# EAGLE design HFT_VHF-UHF-TRX_1V0 (EAGLE 7.7.0)

## Sheet 1 of 6: AX_1
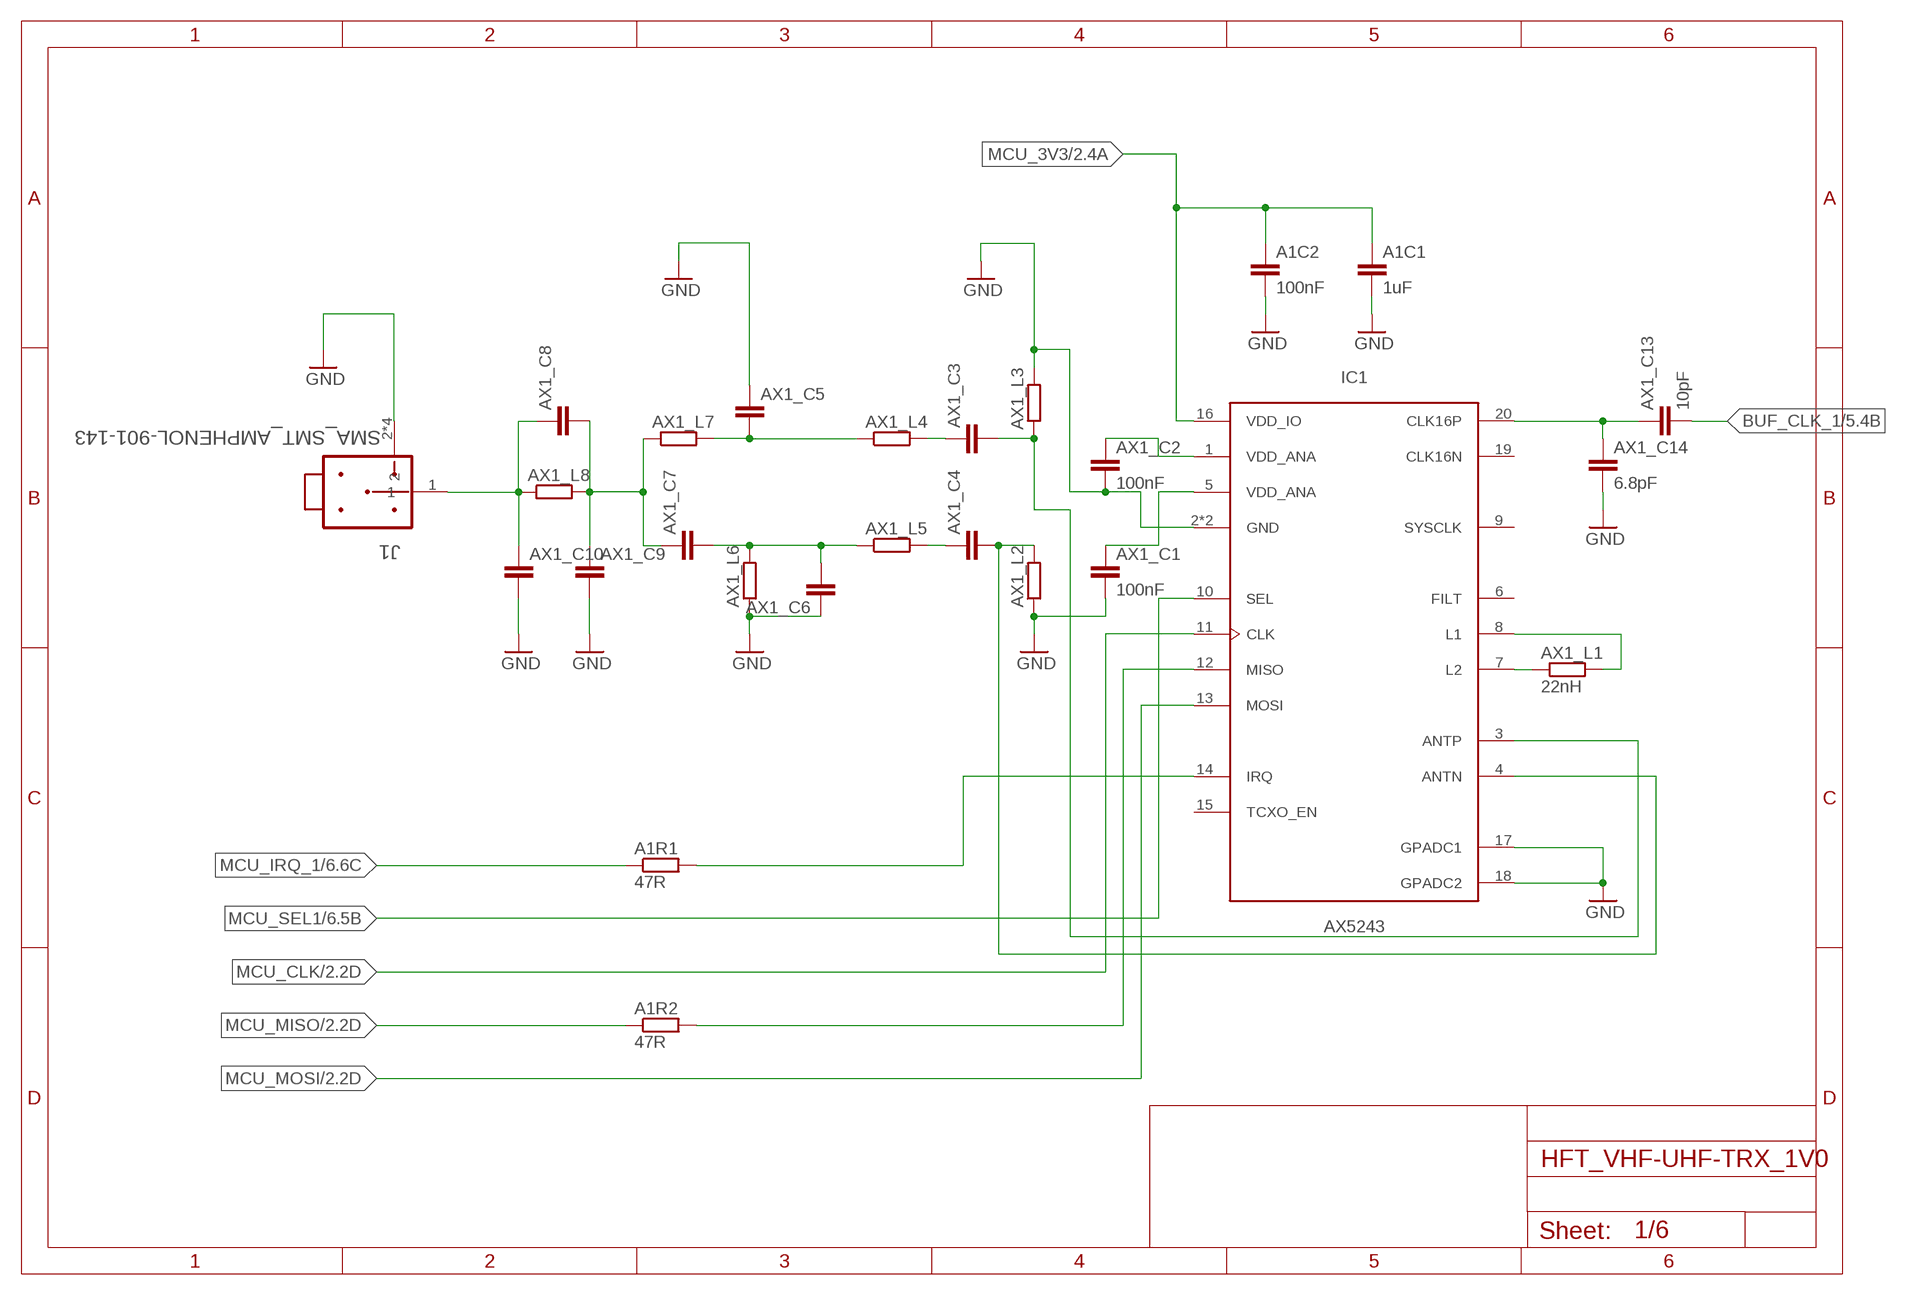
[diagram p0: schematic, sheet 1]

### Parts
A1C1  1uF  C-EUC0805  [C0805]
A1C2  100nF  C-EUC0805  [C0805]
A1R1  47R  R-EU_R0805  [R0805]
A1R2  47R  R-EU_R0805  [R0805]
AX1_C1  100nF  C-EUC0805  [C0805]
AX1_C2  100nF  C-EUC0805  [C0805]
AX1_C3  C-EUC0805  [C0805]
AX1_C4  C-EUC0805  [C0805]
AX1_C5  C-EUC0805  [C0805]
AX1_C6  C-EUC0805  [C0805]
AX1_C7  C-EUC0805  [C0805]
AX1_C8  C-EUC0805  [C0805]
AX1_C9  C-EUC0805  [C0805]
AX1_C10  C-EUC0805  [C0805]
AX1_C13  10pF  C-EUC0805  [C0805]
AX1_C14  6.8pF  C-EUC0805  [C0805]
AX1_L1  22nH  R-EU_R0805  [R0805]
AX1_L2  R-EU_R0805  [R0805]
AX1_L3  R-EU_R0805  [R0805]
AX1_L4  R-EU_R0805  [R0805]
AX1_L5  R-EU_R0805  [R0805]
AX1_L6  R-EU_R0805  [R0805]
AX1_L7  R-EU_R0805  [R0805]
AX1_L8  R-EU_R0805  [R0805]
IC1  AX5243  [QFN20-4X4-0P5-PAD]
J1  SMA_SMT_AMPHENOL-901-143  [SMA_SMT_AMPHENOL_901-143]

### Nets
AX1_C3_L4: AX1_C3.1 AX1_L4.2
AX1_C4_L5: AX1_C4.1 AX1_L5.2
AX1_CH1_ANA1: AX1_C2.1 IC1.1(VDD_ANA)
AX1_CH1_ANA2: AX1_C1.1 IC1.5(VDD_ANA)
AX1_CH1_ANTN: AX1_C4.2 AX1_L2.2 IC1.4(ANTN)
AX1_CH1_ANTP: AX1_C3.2 AX1_L3.1 IC1.3(ANTP)
AX1_CH_1: AX1_C8.1 AX1_C10.1 AX1_L8.1 J1.1
AX1_IRQ_1: A1R1.2 IC1.14(IRQ)
AX1_L1: AX1_L1.2 IC1.8(L1)
AX1_L2: AX1_L1.1 IC1.7(L2)
AX1_L4_C5_L7: AX1_C5.2 AX1_L4.1 AX1_L7.2
AX1_L4_C7_L8: AX1_C7.1 AX1_C8.2 AX1_C9.1 AX1_L7.1 AX1_L8.2
AX1_L5_C6_L6_C7: AX1_C6.2 AX1_C7.2 AX1_L5.1 AX1_L6.2
AX1_MISO: A1R2.2 IC1.12(MISO)
BUF_CLK_1: AX1_C13.2 ; also sheet 5
BUF_CLK_A1: AX1_C13.1 AX1_C14.1 IC1.20(CLK16P)
GND [Hicur]: A1C1.2 A1C2.2 AX1_C1.2 AX1_C2.2 AX1_C5.1 AX1_C6.1 AX1_C9.2 AX1_C10.2 AX1_C14.2 AX1_L2.1 AX1_L3.2 AX1_L6.1 IC1.2(GND) IC1.17(GPADC1) IC1.18(GPADC2) IC1.21(GND) J1.2 J1.3 J1.4 J1.5 ; also sheet 2,3,4,5,6
MCU_3V3 [Hicur]: A1C1.1 A1C2.1 IC1.16(VDD_IO) ; also sheet 2,3,4,5,6
MCU_CLK: IC1.11(CLK) ; also sheet 2,3,4,6
MCU_IRQ_1: A1R1.1 ; also sheet 6
MCU_MISO: A1R2.1 ; also sheet 2,3,4,6
MCU_MOSI: IC1.13(MOSI) ; also sheet 2,3,4,6
MCU_SEL1: IC1.10(SEL) ; also sheet 6
Unconnected: IC1.6(FILT) IC1.9(SYSCLK) IC1.15(TCXO_EN) IC1.19(CLK16N)

## Sheet 2 of 6: AX_2
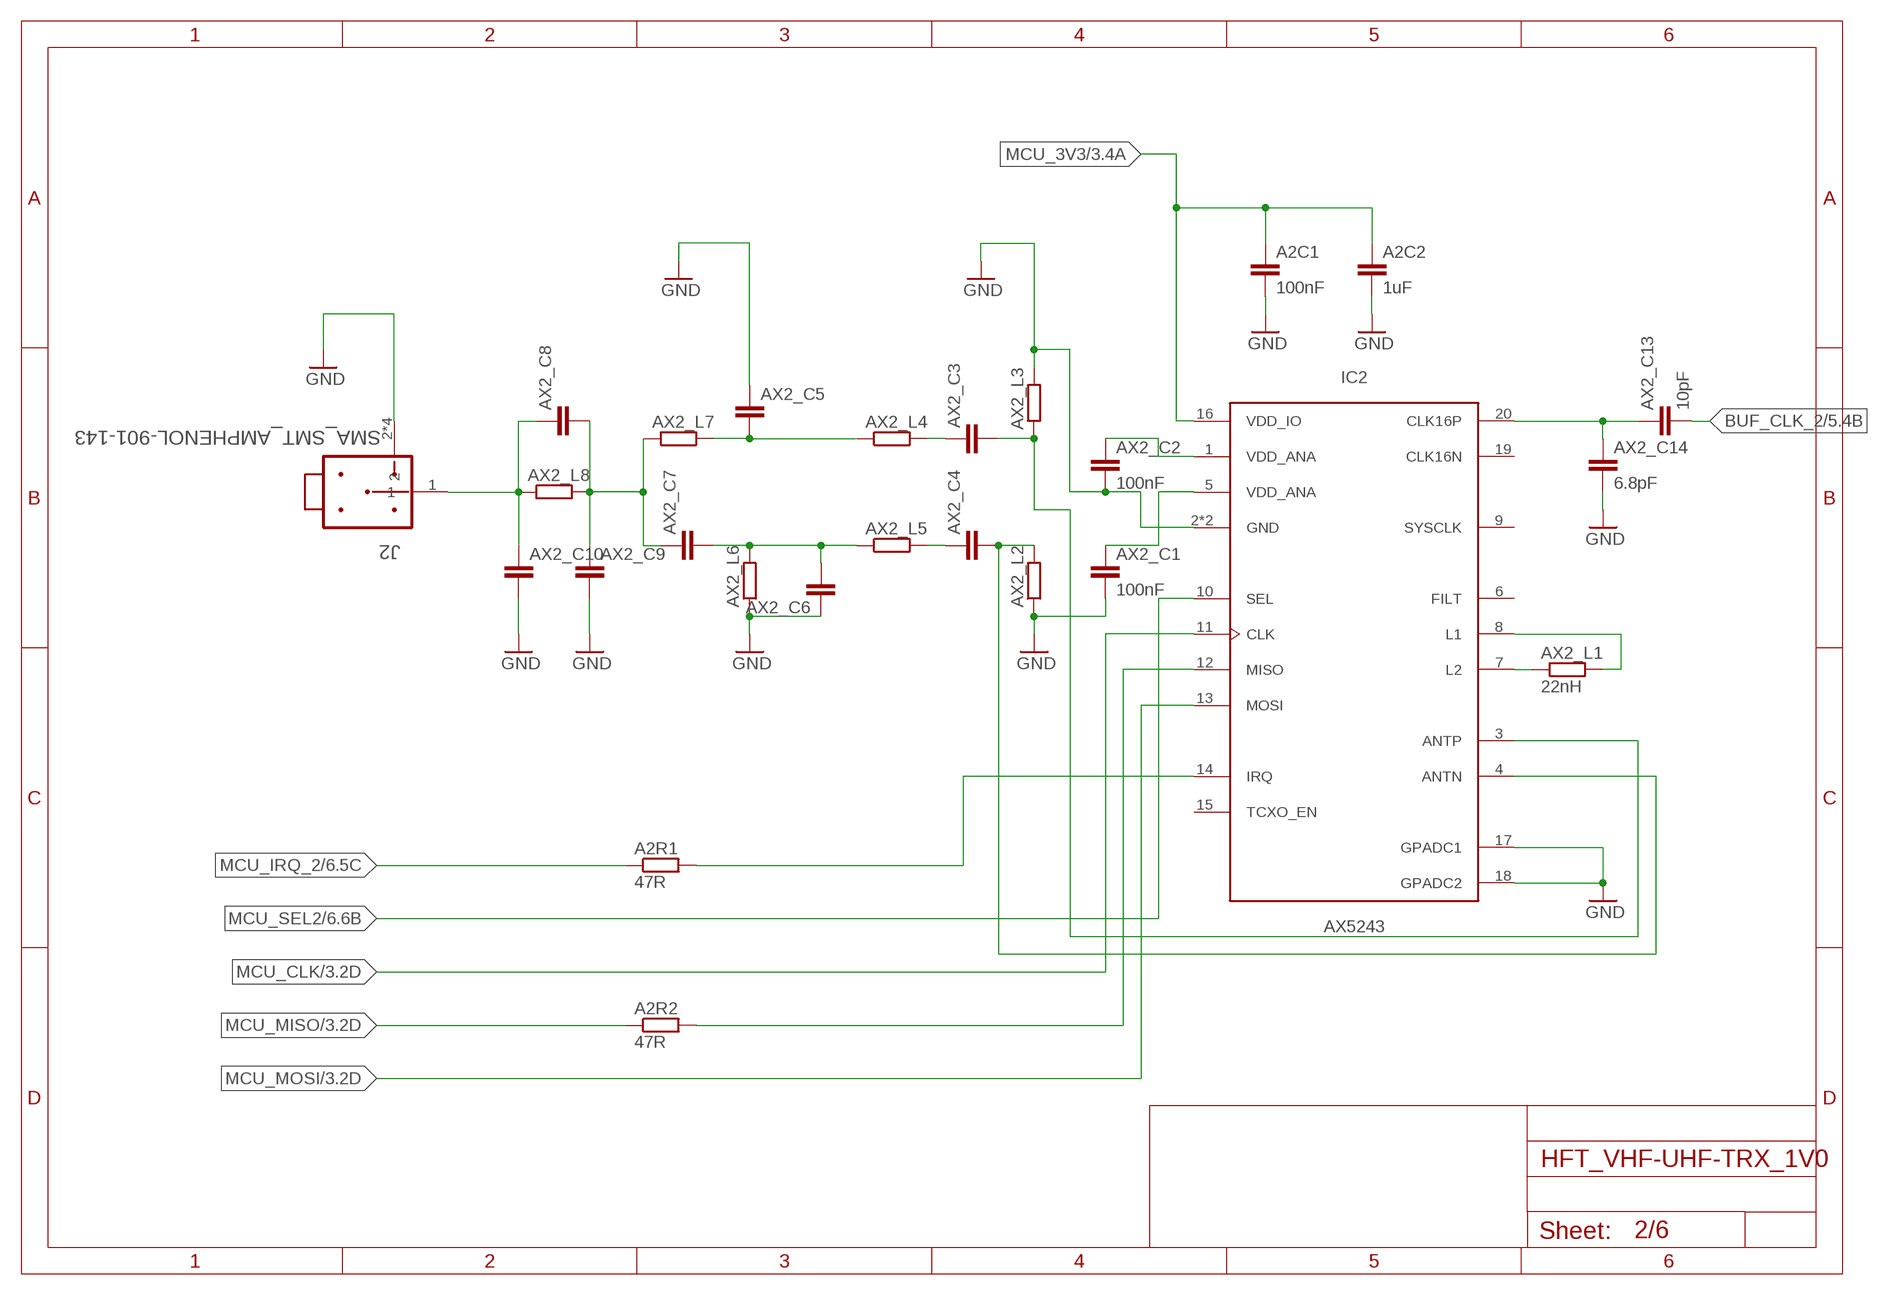
[diagram p1: schematic, sheet 2]

### Parts
A2C1  100nF  C-EUC0805  [C0805]
A2C2  1uF  C-EUC0805  [C0805]
A2R1  47R  R-EU_R0805  [R0805]
A2R2  47R  R-EU_R0805  [R0805]
AX2_C1  100nF  C-EUC0805  [C0805]
AX2_C2  100nF  C-EUC0805  [C0805]
AX2_C3  C-EUC0805  [C0805]
AX2_C4  C-EUC0805  [C0805]
AX2_C5  C-EUC0805  [C0805]
AX2_C6  C-EUC0805  [C0805]
AX2_C7  C-EUC0805  [C0805]
AX2_C8  C-EUC0805  [C0805]
AX2_C9  C-EUC0805  [C0805]
AX2_C10  C-EUC0805  [C0805]
AX2_C13  10pF  C-EUC0805  [C0805]
AX2_C14  6.8pF  C-EUC0805  [C0805]
AX2_L1  22nH  R-EU_R0805  [R0805]
AX2_L2  R-EU_R0805  [R0805]
AX2_L3  R-EU_R0805  [R0805]
AX2_L4  R-EU_R0805  [R0805]
AX2_L5  R-EU_R0805  [R0805]
AX2_L6  R-EU_R0805  [R0805]
AX2_L7  R-EU_R0805  [R0805]
AX2_L8  R-EU_R0805  [R0805]
IC2  AX5243  [QFN20-4X4-0P5-PAD]
J2  SMA_SMT_AMPHENOL-901-143  [SMA_SMT_AMPHENOL_901-143]

### Nets
AX2_C3_L4: AX2_C3.1 AX2_L4.2
AX2_C4_L5: AX2_C4.1 AX2_L5.2
AX2_CH2_ANA1: AX2_C2.1 IC2.1(VDD_ANA)
AX2_CH2_ANA2: AX2_C1.1 IC2.5(VDD_ANA)
AX2_CH2_ANTN: AX2_C4.2 AX2_L2.2 IC2.4(ANTN)
AX2_CH2_ANTP: AX2_C3.2 AX2_L3.1 IC2.3(ANTP)
AX2_CH_2: AX2_C8.1 AX2_C10.1 AX2_L8.1 J2.1
AX2_IRQ_2: A2R1.2 IC2.14(IRQ)
AX2_L1: AX2_L1.2 IC2.8(L1)
AX2_L2: AX2_L1.1 IC2.7(L2)
AX2_L4_C5_L7: AX2_C5.2 AX2_L4.1 AX2_L7.2
AX2_L4_C7_L8: AX2_C7.1 AX2_C8.2 AX2_C9.1 AX2_L7.1 AX2_L8.2
AX2_L5_C6_L6_C7: AX2_C6.2 AX2_C7.2 AX2_L5.1 AX2_L6.2
AX2_MISO: A2R2.2 IC2.12(MISO)
BUF_CLK_2: AX2_C13.2 ; also sheet 5
BUF_CLK_A2: AX2_C13.1 AX2_C14.1 IC2.20(CLK16P)
GND [Hicur]: A2C1.2 A2C2.2 AX2_C1.2 AX2_C2.2 AX2_C5.1 AX2_C6.1 AX2_C9.2 AX2_C10.2 AX2_C14.2 AX2_L2.1 AX2_L3.2 AX2_L6.1 IC2.2(GND) IC2.17(GPADC1) IC2.18(GPADC2) IC2.21(GND) J2.2 J2.3 J2.4 J2.5 ; also sheet 1,3,4,5,6
MCU_3V3 [Hicur]: A2C1.1 A2C2.1 IC2.16(VDD_IO) ; also sheet 1,3,4,5,6
MCU_CLK: IC2.11(CLK) ; also sheet 1,3,4,6
MCU_IRQ_2: A2R1.1 ; also sheet 6
MCU_MISO: A2R2.1 ; also sheet 1,3,4,6
MCU_MOSI: IC2.13(MOSI) ; also sheet 1,3,4,6
MCU_SEL2: IC2.10(SEL) ; also sheet 6
Unconnected: IC2.6(FILT) IC2.9(SYSCLK) IC2.15(TCXO_EN) IC2.19(CLK16N)

## Sheet 3 of 6: AX_3
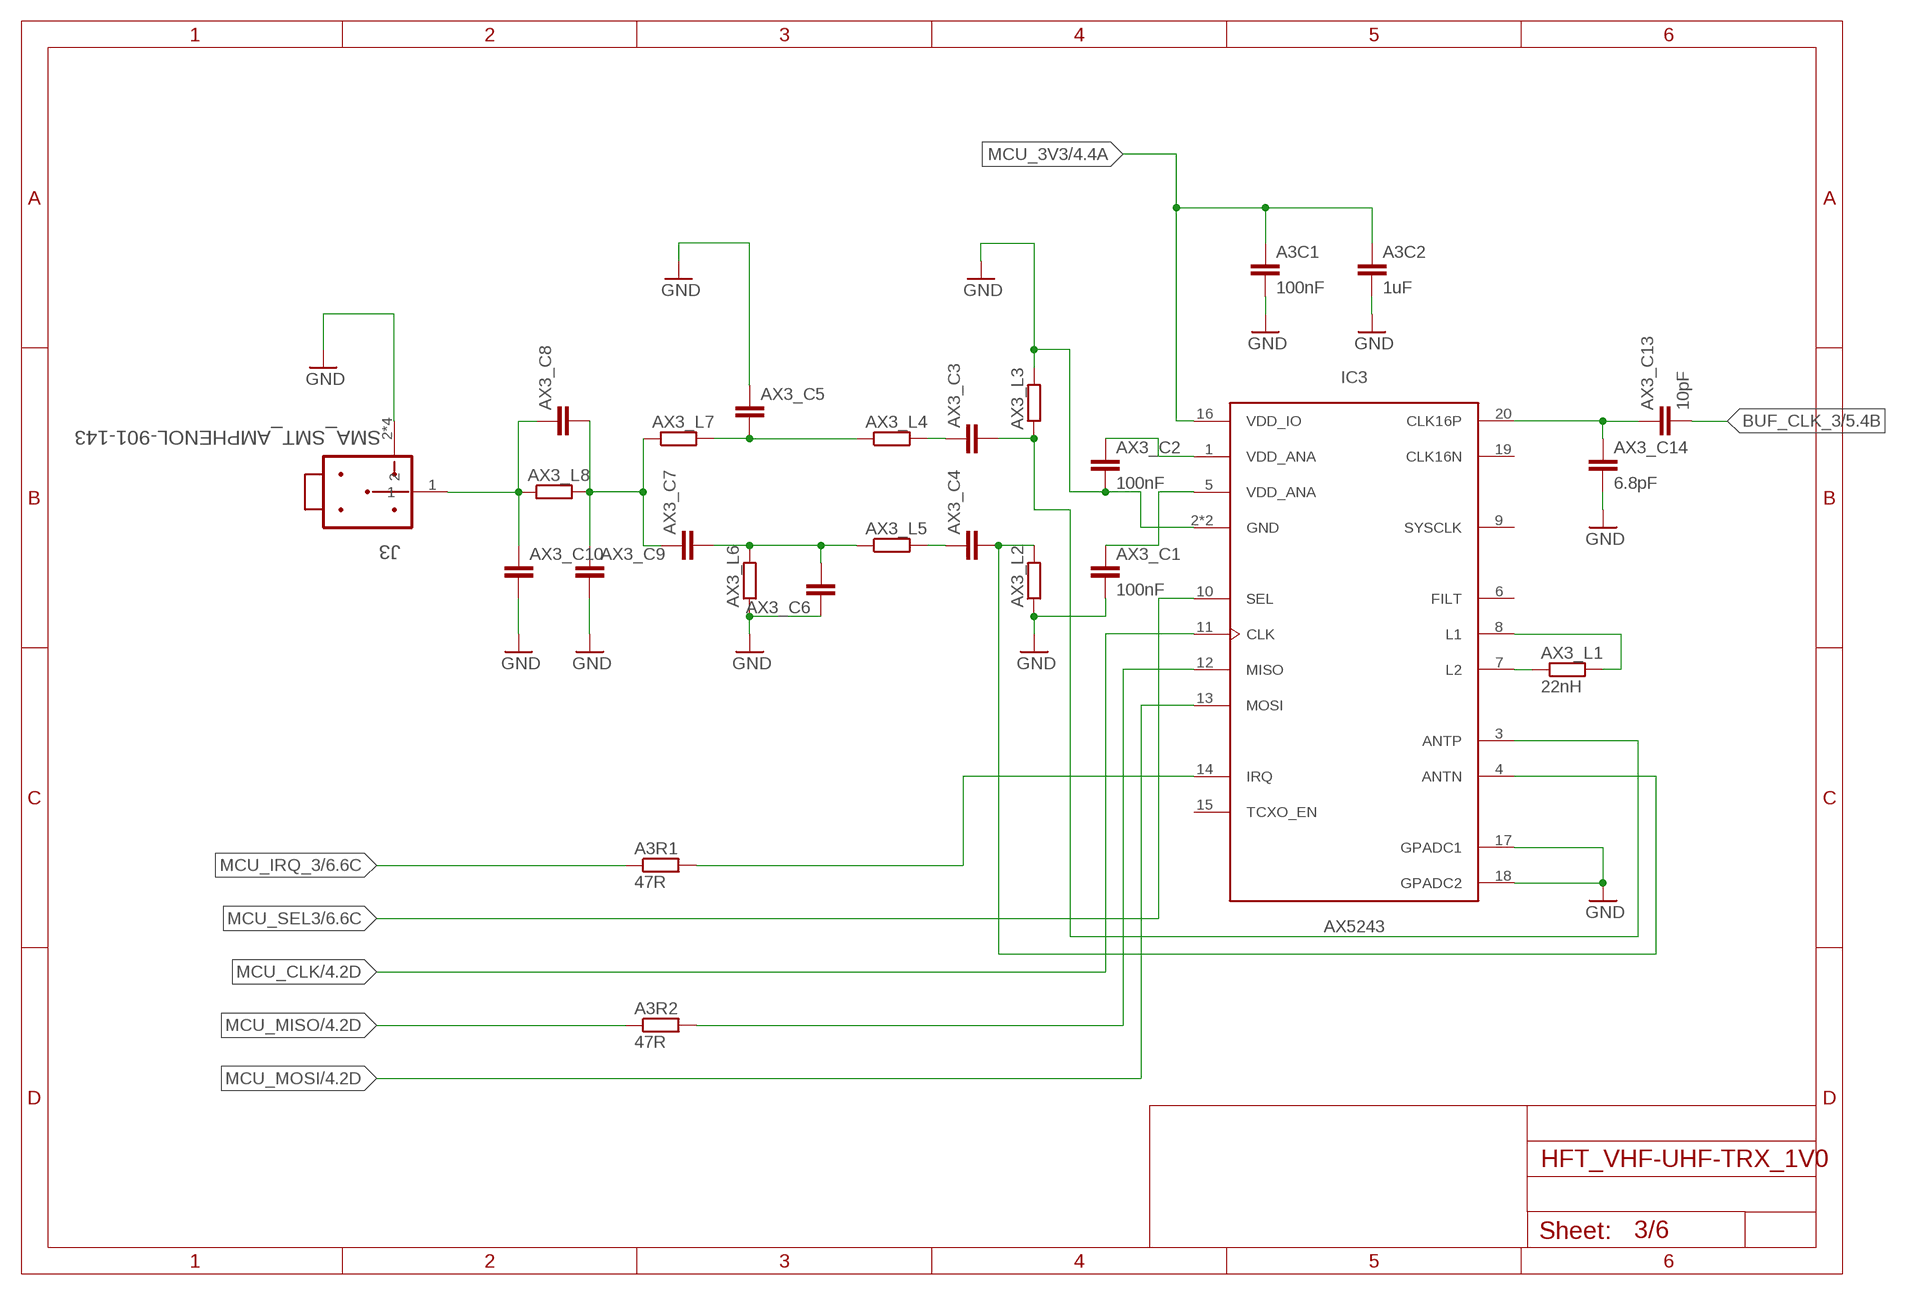
[diagram p2: schematic, sheet 3]

### Parts
A3C1  100nF  C-EUC0805  [C0805]
A3C2  1uF  C-EUC0805  [C0805]
A3R1  47R  R-EU_R0805  [R0805]
A3R2  47R  R-EU_R0805  [R0805]
AX3_C1  100nF  C-EUC0805  [C0805]
AX3_C2  100nF  C-EUC0805  [C0805]
AX3_C3  C-EUC0805  [C0805]
AX3_C4  C-EUC0805  [C0805]
AX3_C5  C-EUC0805  [C0805]
AX3_C6  C-EUC0805  [C0805]
AX3_C7  C-EUC0805  [C0805]
AX3_C8  C-EUC0805  [C0805]
AX3_C9  C-EUC0805  [C0805]
AX3_C10  C-EUC0805  [C0805]
AX3_C13  10pF  C-EUC0805  [C0805]
AX3_C14  6.8pF  C-EUC0805  [C0805]
AX3_L1  22nH  R-EU_R0805  [R0805]
AX3_L2  R-EU_R0805  [R0805]
AX3_L3  R-EU_R0805  [R0805]
AX3_L4  R-EU_R0805  [R0805]
AX3_L5  R-EU_R0805  [R0805]
AX3_L6  R-EU_R0805  [R0805]
AX3_L7  R-EU_R0805  [R0805]
AX3_L8  R-EU_R0805  [R0805]
IC3  AX5243  [QFN20-4X4-0P5-PAD]
J3  SMA_SMT_AMPHENOL-901-143  [SMA_SMT_AMPHENOL_901-143]

### Nets
AX3_C3_L4: AX3_C3.1 AX3_L4.2
AX3_C4_L5: AX3_C4.1 AX3_L5.2
AX3_CH3_ANA1: AX3_C2.1 IC3.1(VDD_ANA)
AX3_CH3_ANA2: AX3_C1.1 IC3.5(VDD_ANA)
AX3_CH3_ANTN: AX3_C4.2 AX3_L2.2 IC3.4(ANTN)
AX3_CH3_ANTP: AX3_C3.2 AX3_L3.1 IC3.3(ANTP)
AX3_CH_3: AX3_C8.1 AX3_C10.1 AX3_L8.1 J3.1
AX3_IRQ_3: A3R1.2 IC3.14(IRQ)
AX3_L1: AX3_L1.2 IC3.8(L1)
AX3_L2: AX3_L1.1 IC3.7(L2)
AX3_L4_C5_L7: AX3_C5.2 AX3_L4.1 AX3_L7.2
AX3_L4_C7_L8: AX3_C7.1 AX3_C8.2 AX3_C9.1 AX3_L7.1 AX3_L8.2
AX3_L5_C6_L6_C7: AX3_C6.2 AX3_C7.2 AX3_L5.1 AX3_L6.2
AX3_MISO: A3R2.2 IC3.12(MISO)
BUF_CLK_3: AX3_C13.2 ; also sheet 5
BUF_CLK_A3: AX3_C13.1 AX3_C14.1 IC3.20(CLK16P)
GND [Hicur]: A3C1.2 A3C2.2 AX3_C1.2 AX3_C2.2 AX3_C5.1 AX3_C6.1 AX3_C9.2 AX3_C10.2 AX3_C14.2 AX3_L2.1 AX3_L3.2 AX3_L6.1 IC3.2(GND) IC3.17(GPADC1) IC3.18(GPADC2) IC3.21(GND) J3.2 J3.3 J3.4 J3.5 ; also sheet 1,2,4,5,6
MCU_3V3 [Hicur]: A3C1.1 A3C2.1 IC3.16(VDD_IO) ; also sheet 1,2,4,5,6
MCU_CLK: IC3.11(CLK) ; also sheet 1,2,4,6
MCU_IRQ_3: A3R1.1 ; also sheet 6
MCU_MISO: A3R2.1 ; also sheet 1,2,4,6
MCU_MOSI: IC3.13(MOSI) ; also sheet 1,2,4,6
MCU_SEL3: IC3.10(SEL) ; also sheet 6
Unconnected: IC3.6(FILT) IC3.9(SYSCLK) IC3.15(TCXO_EN) IC3.19(CLK16N)

## Sheet 4 of 6: AX_4
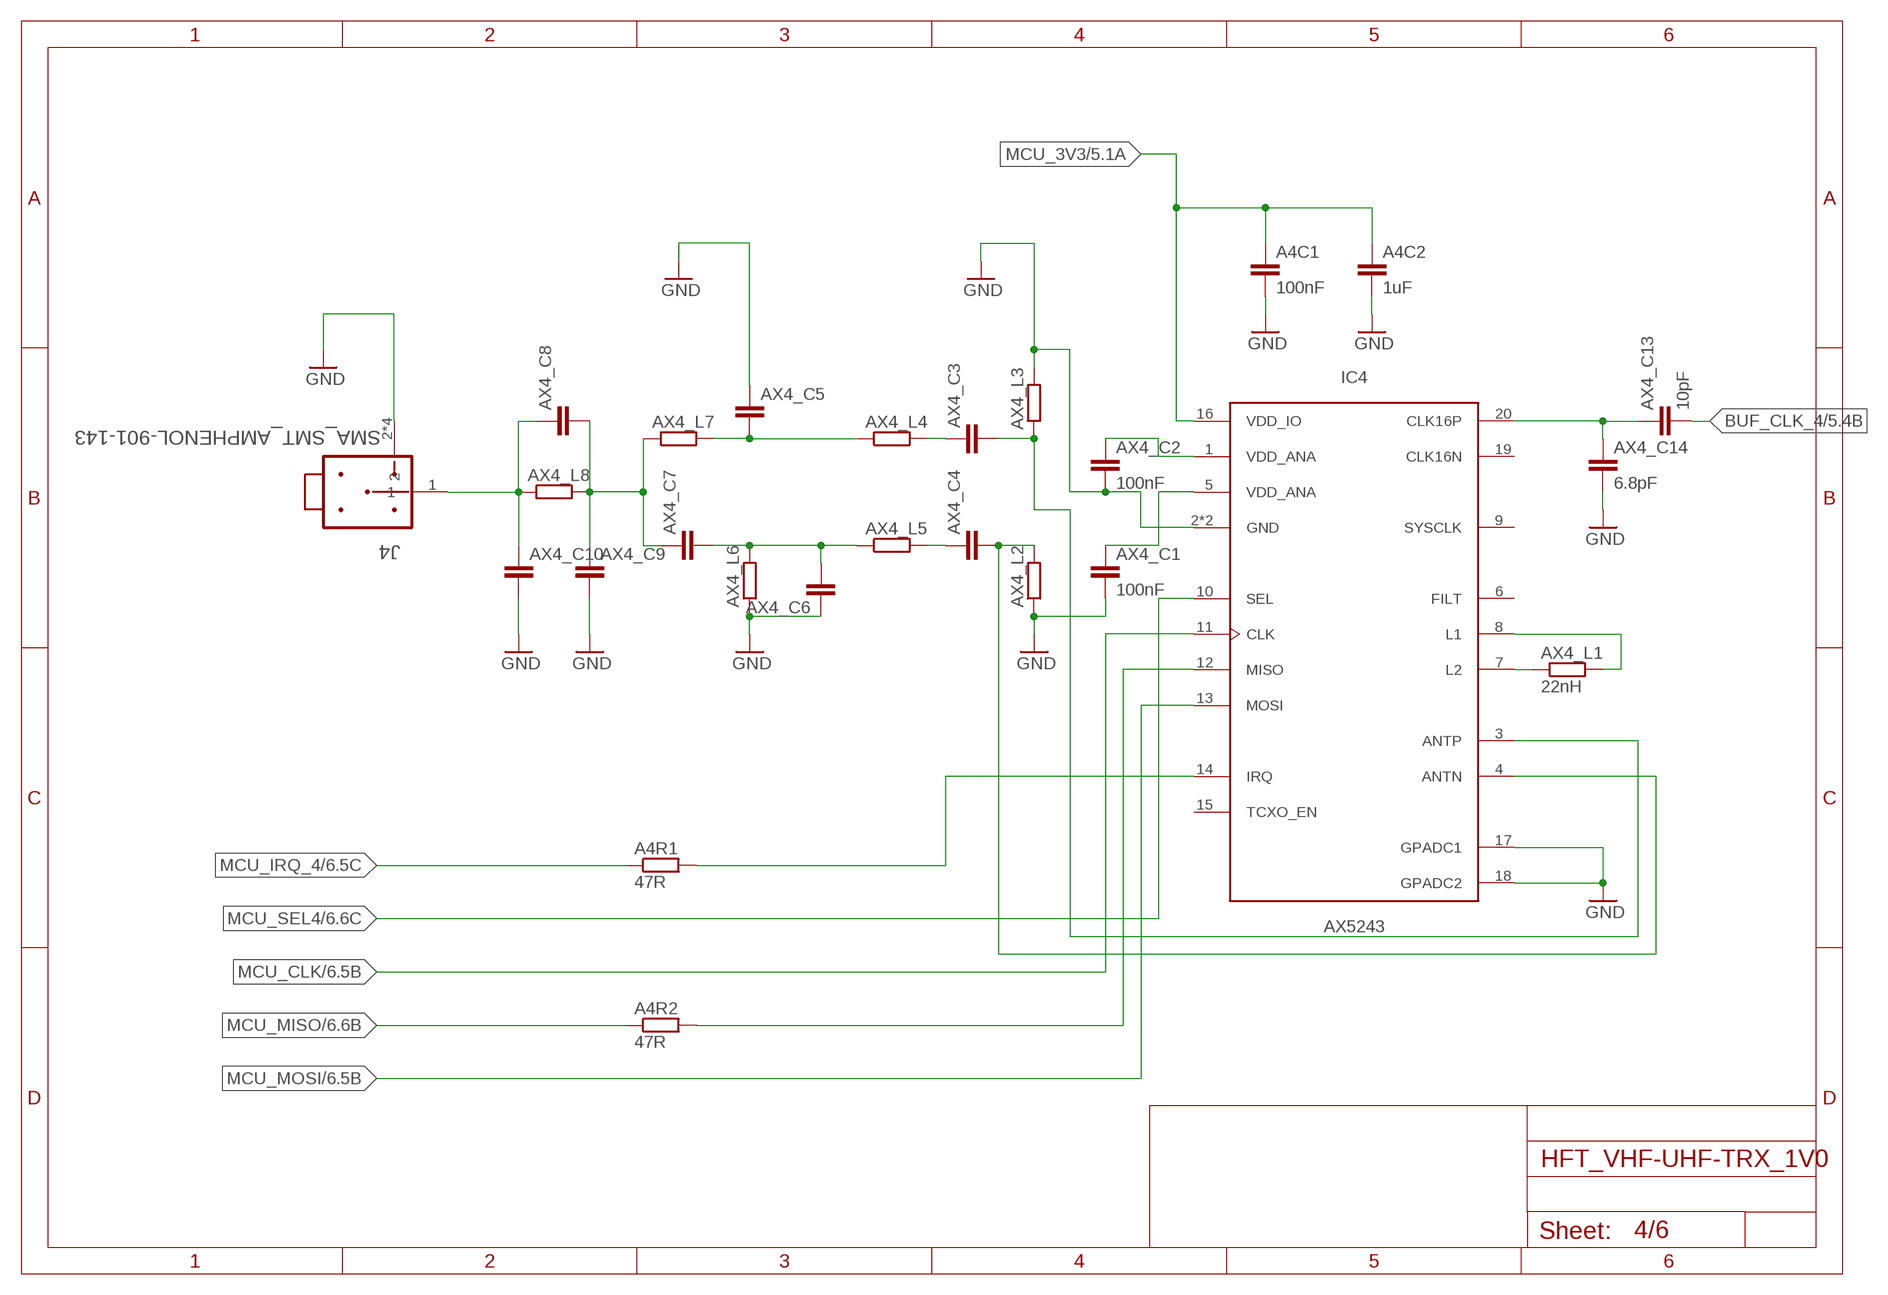
[diagram p3: schematic, sheet 4]

### Parts
A4C1  100nF  C-EUC0805  [C0805]
A4C2  1uF  C-EUC0805  [C0805]
A4R1  47R  R-EU_R0805  [R0805]
A4R2  47R  R-EU_R0805  [R0805]
AX4_C1  100nF  C-EUC0805  [C0805]
AX4_C2  100nF  C-EUC0805  [C0805]
AX4_C3  C-EUC0805  [C0805]
AX4_C4  C-EUC0805  [C0805]
AX4_C5  C-EUC0805  [C0805]
AX4_C6  C-EUC0805  [C0805]
AX4_C7  C-EUC0805  [C0805]
AX4_C8  C-EUC0805  [C0805]
AX4_C9  C-EUC0805  [C0805]
AX4_C10  C-EUC0805  [C0805]
AX4_C13  10pF  C-EUC0805  [C0805]
AX4_C14  6.8pF  C-EUC0805  [C0805]
AX4_L1  22nH  R-EU_R0805  [R0805]
AX4_L2  R-EU_R0805  [R0805]
AX4_L3  R-EU_R0805  [R0805]
AX4_L4  R-EU_R0805  [R0805]
AX4_L5  R-EU_R0805  [R0805]
AX4_L6  R-EU_R0805  [R0805]
AX4_L7  R-EU_R0805  [R0805]
AX4_L8  R-EU_R0805  [R0805]
IC4  AX5243  [QFN20-4X4-0P5-PAD]
J4  SMA_SMT_AMPHENOL-901-143  [SMA_SMT_AMPHENOL_901-143]

### Nets
AX4_C3_L4: AX4_C3.1 AX4_L4.2
AX4_C4_L5: AX4_C4.1 AX4_L5.2
AX4_CH4_ANA1: AX4_C2.1 IC4.1(VDD_ANA)
AX4_CH4_ANA2: AX4_C1.1 IC4.5(VDD_ANA)
AX4_CH4_ANTN: AX4_C4.2 AX4_L2.2 IC4.4(ANTN)
AX4_CH4_ANTP: AX4_C3.2 AX4_L3.1 IC4.3(ANTP)
AX4_CH_4: AX4_C8.1 AX4_C10.1 AX4_L8.1 J4.1
AX4_IRQ_4: A4R1.2 IC4.14(IRQ)
AX4_L1: AX4_L1.2 IC4.8(L1)
AX4_L2: AX4_L1.1 IC4.7(L2)
AX4_L4_C5_L7: AX4_C5.2 AX4_L4.1 AX4_L7.2
AX4_L4_C7_L8: AX4_C7.1 AX4_C8.2 AX4_C9.1 AX4_L7.1 AX4_L8.2
AX4_L5_C6_L6_C7: AX4_C6.2 AX4_C7.2 AX4_L5.1 AX4_L6.2
AX4_MISO: A4R2.2 IC4.12(MISO)
BUF_CLK_4: AX4_C13.2 ; also sheet 5
BUF_CLK_A4: AX4_C13.1 AX4_C14.1 IC4.20(CLK16P)
GND [Hicur]: A4C1.2 A4C2.2 AX4_C1.2 AX4_C2.2 AX4_C5.1 AX4_C6.1 AX4_C9.2 AX4_C10.2 AX4_C14.2 AX4_L2.1 AX4_L3.2 AX4_L6.1 IC4.2(GND) IC4.17(GPADC1) IC4.18(GPADC2) IC4.21(GND) J4.2 J4.3 J4.4 J4.5 ; also sheet 1,2,3,5,6
MCU_3V3 [Hicur]: A4C1.1 A4C2.1 IC4.16(VDD_IO) ; also sheet 1,2,3,5,6
MCU_CLK: IC4.11(CLK) ; also sheet 1,2,3,6
MCU_IRQ_4: A4R1.1 ; also sheet 6
MCU_MISO: A4R2.1 ; also sheet 1,2,3,6
MCU_MOSI: IC4.13(MOSI) ; also sheet 1,2,3,6
MCU_SEL4: IC4.10(SEL) ; also sheet 6
Unconnected: IC4.6(FILT) IC4.9(SYSCLK) IC4.15(TCXO_EN) IC4.19(CLK16N)

## Sheet 5 of 6: Clock Buffer
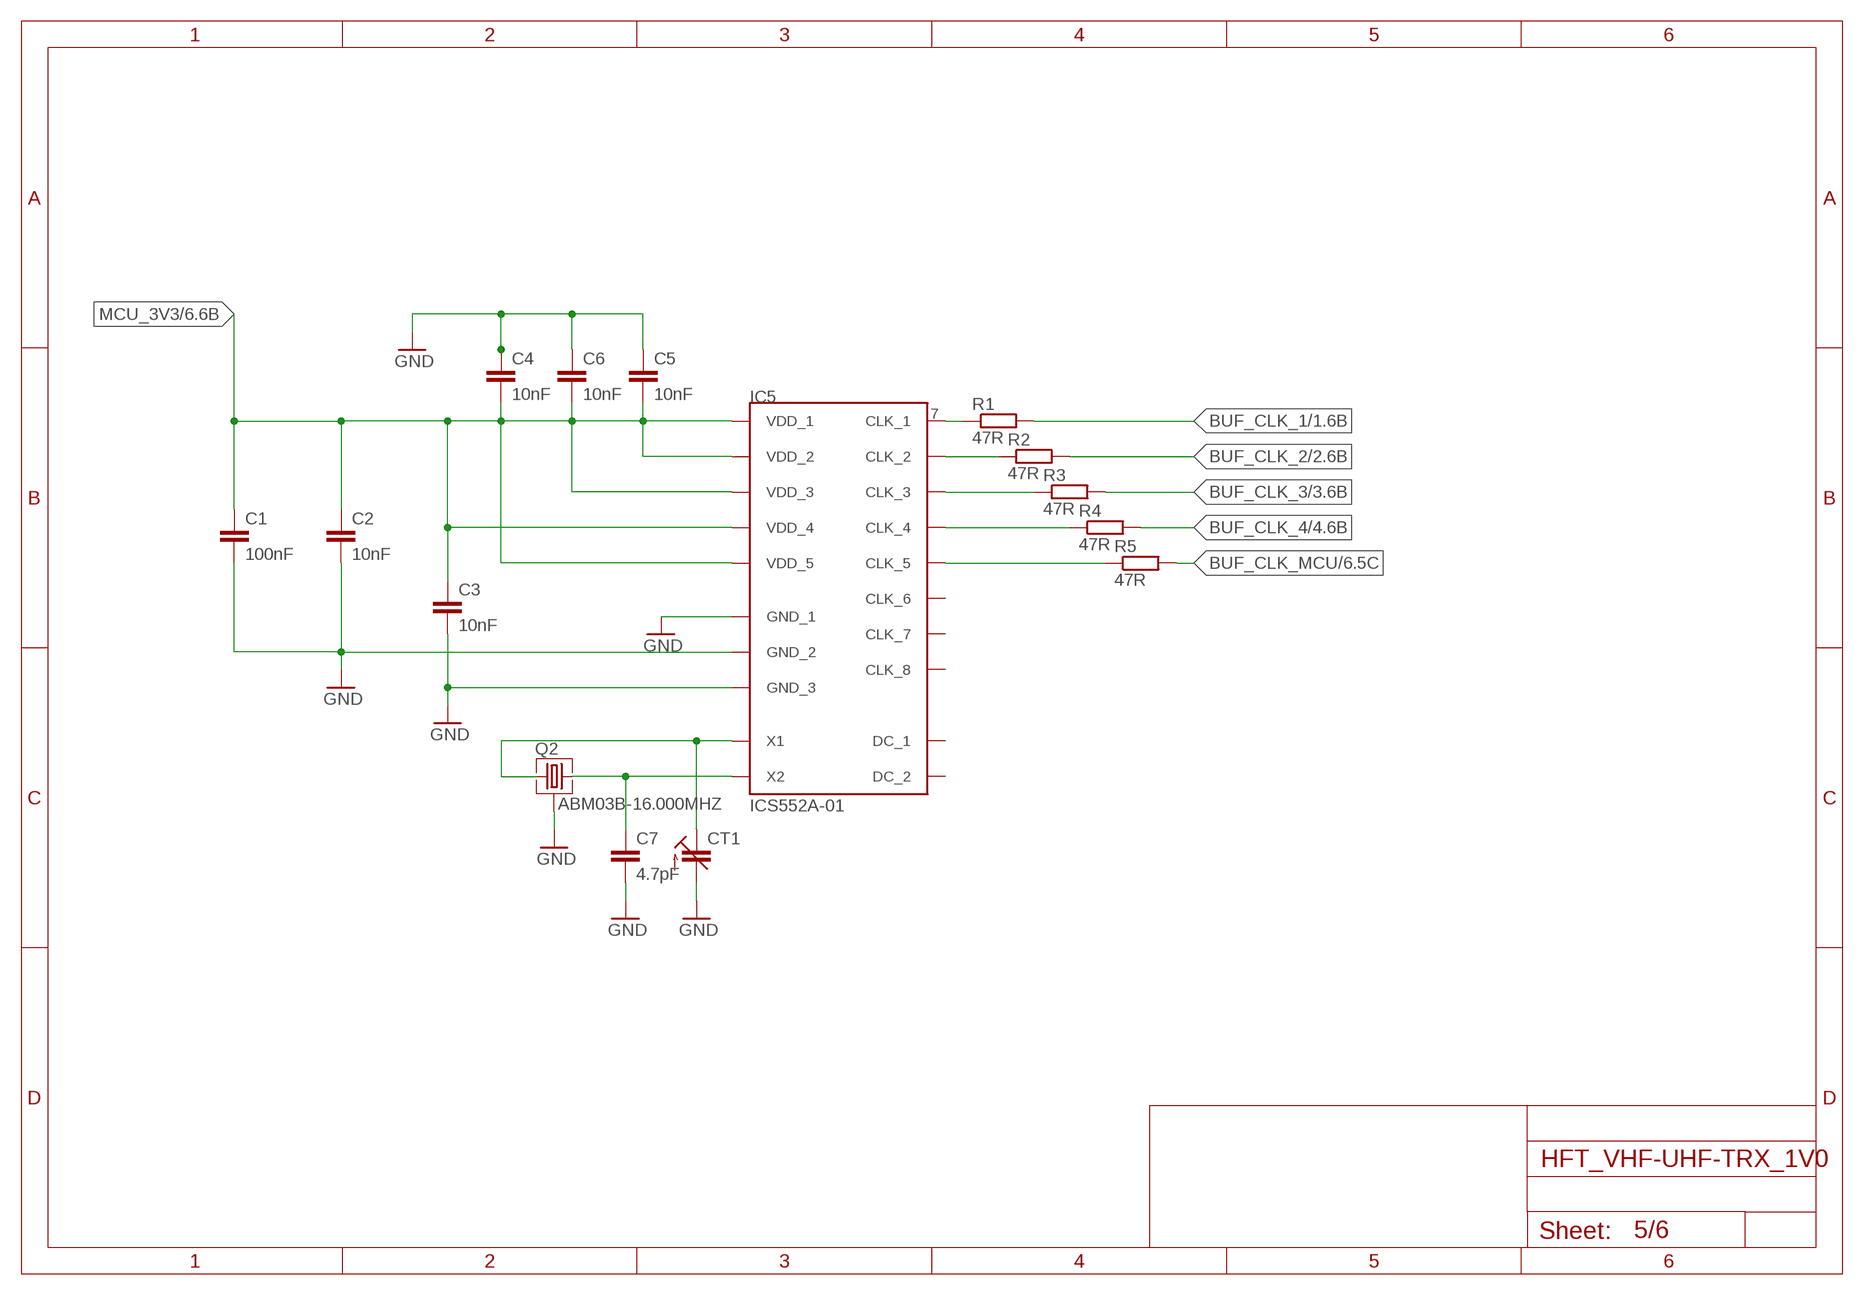
[diagram p4: schematic, sheet 5]

### Parts
C1  100nF  C-EUC0805  [C0805]
C2  10nF  C-EUC0805  [C0805]
C3  10nF  C-EUC0805  [C0805]
C4  10nF  C-EUC0805  [C0805]
C5  10nF  C-EUC0805  [C0805]
C6  10nF  C-EUC0805  [C0805]
C7  4.7pF  C-EUC0805  [C0805]
CT1  C-TRIMM3MM2_2MM5  [3MM2_X_2MM5]
IC5  ICS552A-01  [SSOP20]
Q2  ABM03B-16.000MHZ  [ABM03B]
R1  47R  R-EU_R0805  [R0805]
R2  47R  R-EU_R0805  [R0805]
R3  47R  R-EU_R0805  [R0805]
R4  47R  R-EU_R0805  [R0805]
R5  47R  R-EU_R0805  [R0805]

### Nets
BUF_CLK_1: R1.2 ; also sheet 1
BUF_CLK_2: R2.2 ; also sheet 2
BUF_CLK_3: R3.2 ; also sheet 3
BUF_CLK_4: R4.2 ; also sheet 4
BUF_CLK_MCU: R5.2 ; also sheet 6
BUF_O_CLK_1: IC5.7(CLK_1) R1.1
BUF_O_CLK_2: IC5.8(CLK_2) R2.1
BUF_O_CLK_3: IC5.9(CLK_3) R3.1
BUF_O_CLK_4: IC5.10(CLK_4) R4.1
BUF_O_CLK_MCU: IC5.12(CLK_5) R5.1
BUFF_X1: CT1.-(E) IC5.3(X1) Q2.1
BUFF_X2: C7.1 IC5.2(X2) Q2.3
GND [Hicur]: C1.2 C2.2 C3.2 C4.1 C5.1 C6.1 C7.2 CT1.+(A) IC5.5(GND_1) IC5.6(GND_2) IC5.14(GND_3) Q2.2 Q2.4 ; also sheet 1,2,3,4,6
MCU_3V3 [Hicur]: C1.1 C2.1 C3.1 C4.2 C5.2 C6.2 IC5.4(VDD_1) IC5.11(VDD_2) IC5.15(VDD_3) IC5.16(VDD_4) IC5.20(VDD_5) ; also sheet 1,2,3,4,6
Unconnected: IC5.1(DC_1) IC5.13(CLK_6) IC5.17(CLK_7) IC5.18(CLK_8) IC5.19(DC_2)

## Sheet 6 of 6: Connectors
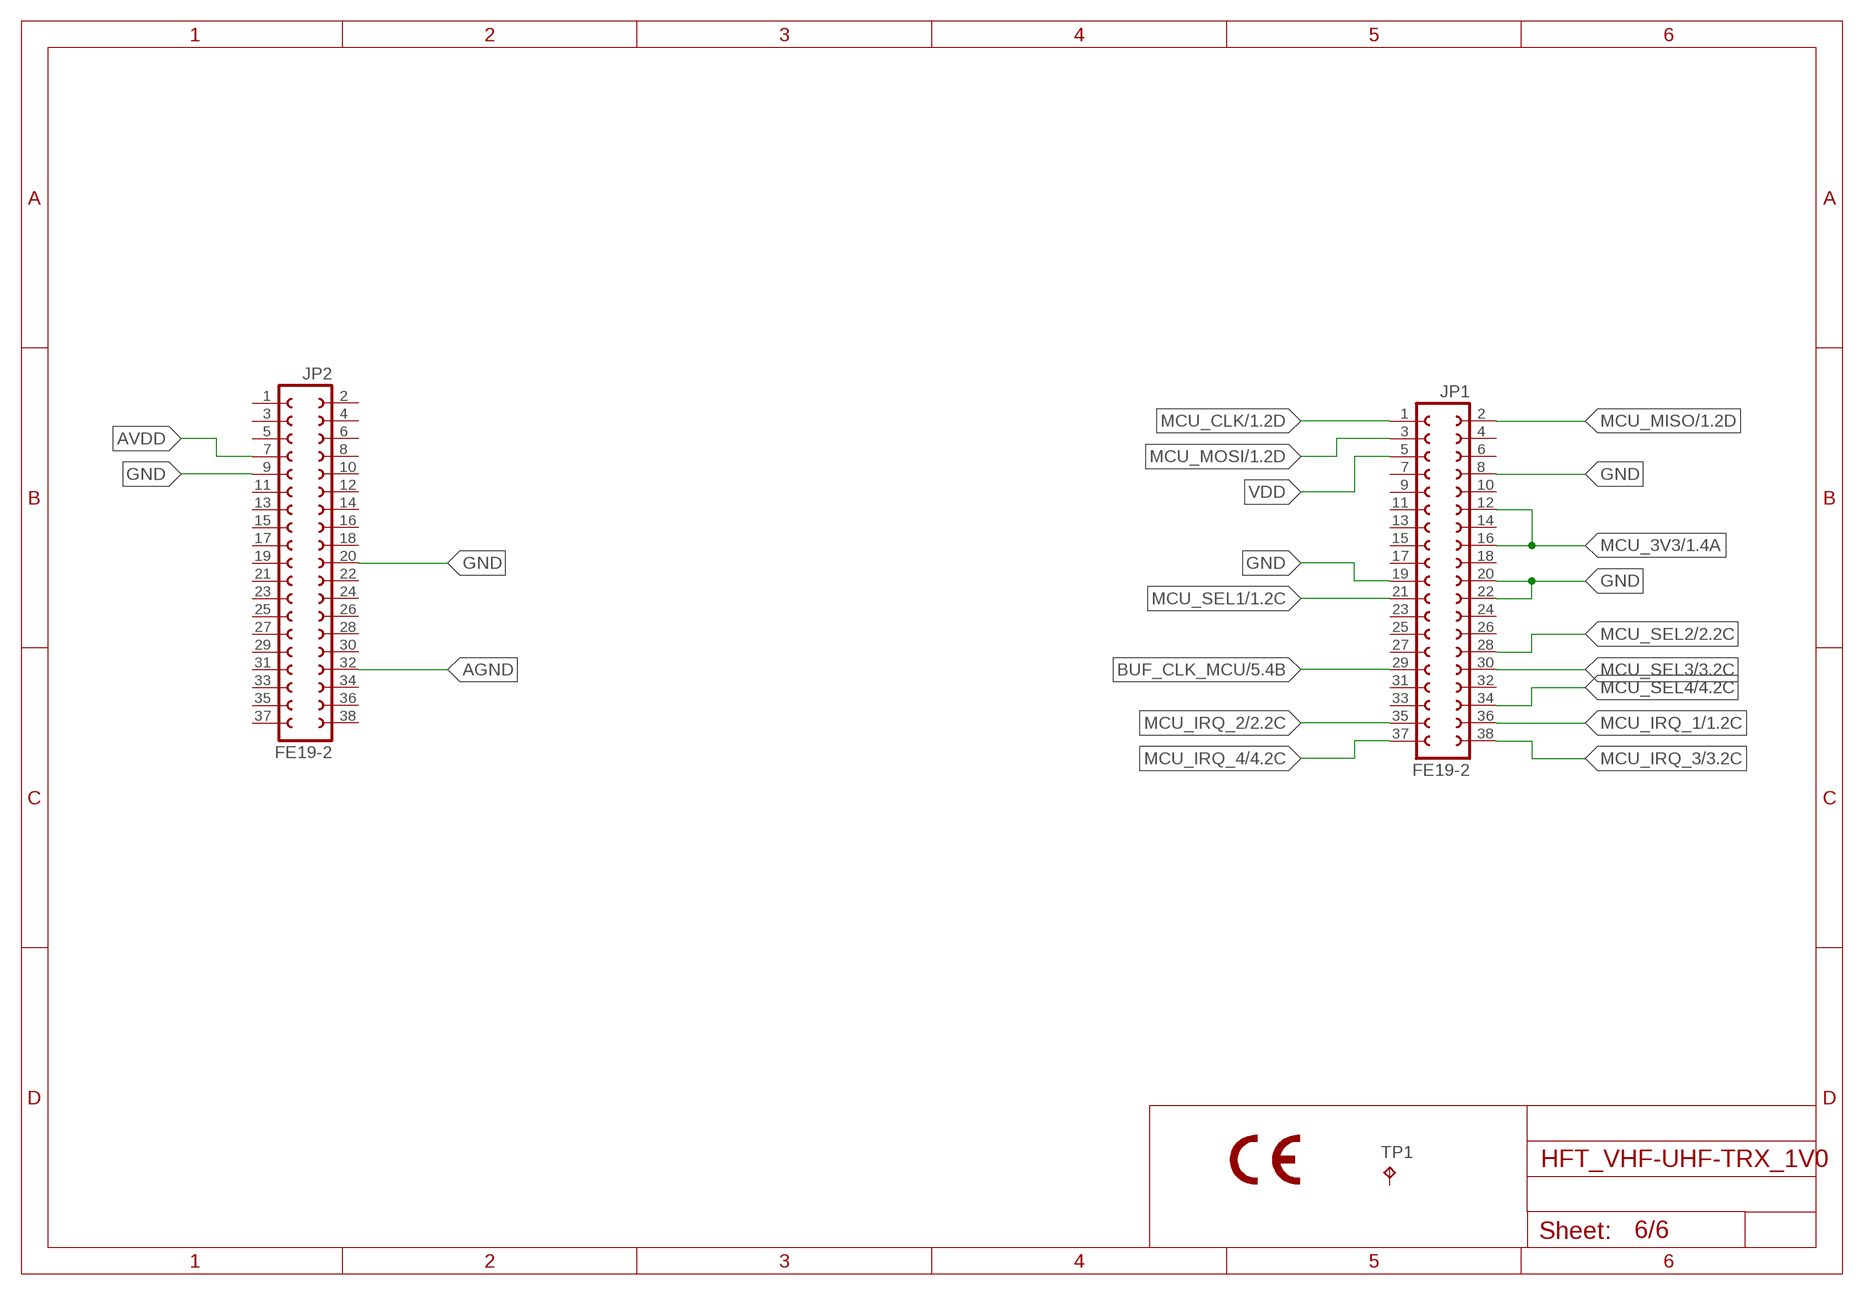
[diagram p5: schematic, sheet 6]

### Parts
JP1  FE19-2  [FE19-2]
JP2  FE19-2  [FE19-2]
TP1  TPB1,27  [B1,27]

### Nets
AGND: JP2.32
AVDD: JP2.7
BUF_CLK_MCU: JP1.29 ; also sheet 5
GND [Hicur]: JP1.8 JP1.19 JP1.20 JP1.22 JP2.9 JP2.20 ; also sheet 1,2,3,4,5
MCU_3V3 [Hicur]: JP1.12 JP1.16 ; also sheet 1,2,3,4,5
MCU_CLK: JP1.1 ; also sheet 1,2,3,4
MCU_IRQ_1: JP1.36 ; also sheet 1
MCU_IRQ_2: JP1.35 ; also sheet 2
MCU_IRQ_3: JP1.38 ; also sheet 3
MCU_IRQ_4: JP1.37 ; also sheet 4
MCU_MISO: JP1.2 ; also sheet 1,2,3,4
MCU_MOSI: JP1.3 ; also sheet 1,2,3,4
MCU_SEL1: JP1.21 ; also sheet 1
MCU_SEL2: JP1.28 ; also sheet 2
MCU_SEL3: JP1.30 ; also sheet 3
MCU_SEL4: JP1.34 ; also sheet 4
VDD: JP1.5
Unconnected: JP1.4 JP1.6 JP1.7 JP1.9 JP1.10 JP1.11 JP1.13 JP1.14 JP1.15 JP1.17 JP1.18 JP1.23 JP1.24 JP1.25 JP1.26 JP1.27 JP1.31 JP1.32 JP1.33 JP2.1 JP2.2 JP2.3 JP2.4 JP2.5 JP2.6 JP2.8 JP2.10 JP2.11 JP2.12 JP2.13 JP2.14 JP2.15 JP2.16 JP2.17 JP2.18 JP2.19 JP2.21 JP2.22 JP2.23 JP2.24 JP2.25 JP2.26 JP2.27 JP2.28 JP2.29 JP2.30 JP2.31 JP2.33 JP2.34 JP2.35 JP2.36 JP2.37 JP2.38 TP1.TP

## Library data of the parts
A1C1 A1C2 A2C1 A2C2 A3C1 A3C2 A4C1 A4C2 AX1_C1-AX1_C10 AX1_C13 AX1_C14 AX2_C1-AX2_C10 AX2_C13 AX2_C14 AX3_C1-AX3_C10 AX3_C13 AX3_C14 AX4_C1-AX4_C10 AX4_C13 AX4_C14 C1-C7 = rcl:C-EU: CAPACITOR, European symbol
A1R1 A1R2 A2R1 A2R2 A3R1 A3R2 A4R1 A4R2 AX1_L1-AX1_L8 AX2_L1-AX2_L8 AX3_L1-AX3_L8 AX4_L1-AX4_L8 R1-R5 = rcl:R-EU_: RESISTOR, European symbol
CT1 = df4iah_c-trimm:C-TRIMM: Trimm capacitor
IC1-IC4 = df4iah_rf:AX5243: AX5243 Advanced High Performance ASK and FSK Narrow-band Transceiver for 27 - 1050 MHz Range Reference: http://www.onsemi.com/PowerSolutions/product.do?id=AX5243
IC5 = IDT:ICS552A-01: IDT ICS552A-01 Variant: Mode-C OSCILLATOR, MULTIPLIER, AND BUFFER WITH 8 OUTPUTS
J1-J4 = df4iah_connector:SMA_SMT_AMPHENOL-901-143: RF/COAXIAL, SMA JACK, R/A, 50OHM, THD; MPN: 901-143; OC_FARNELL: 1461631; OC_NEWARK: 51F3841; PACKAGE: RF/COAXIAL, SMA JACK, R/A, 50OHM, THD; SUPPLIER: Amphenol
JP1 JP2 = con-lsta_2:FE19-2
Q2 = df4iah_crystal:ABM03B-16.000MHZ: ABRACON ABM03B 16.000 MHz CERAMIC SMD CRYSTAL Source: http://www.abracon.com/Resonators/abm3b.pdf
TP1 = testpad:TP: Test pad

## Net classes
1 Hicur: width 0.5 mm

## Board
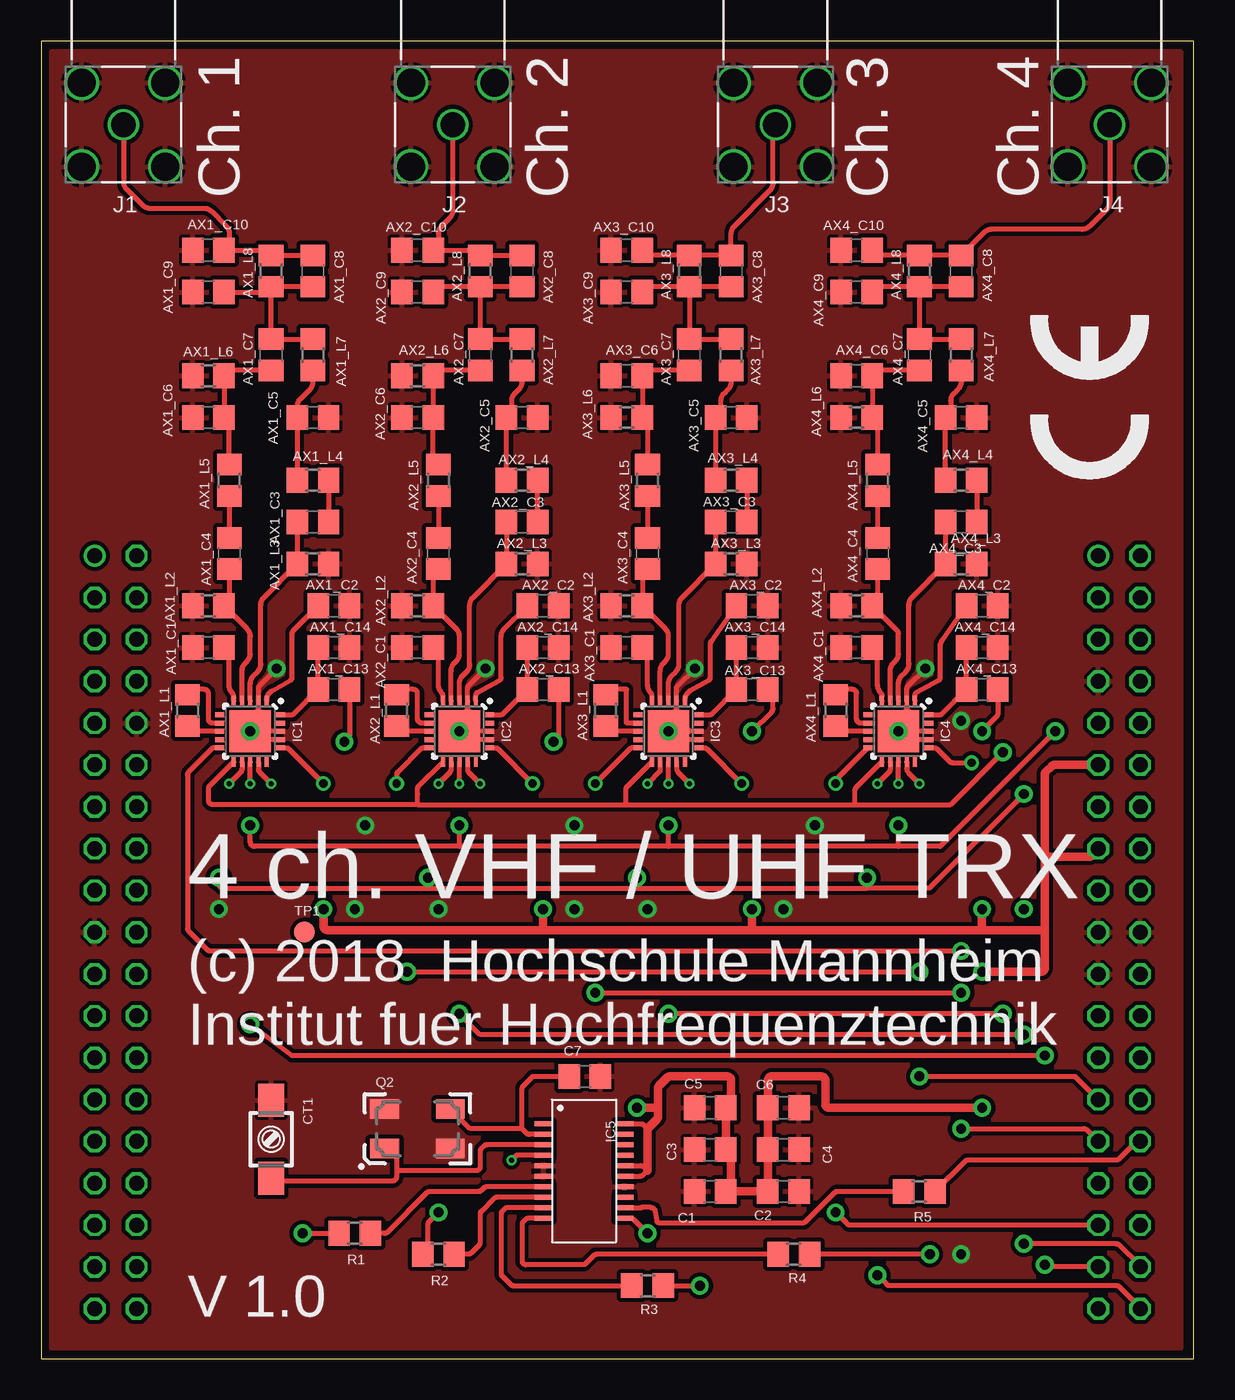
[diagram p6: board, top side]
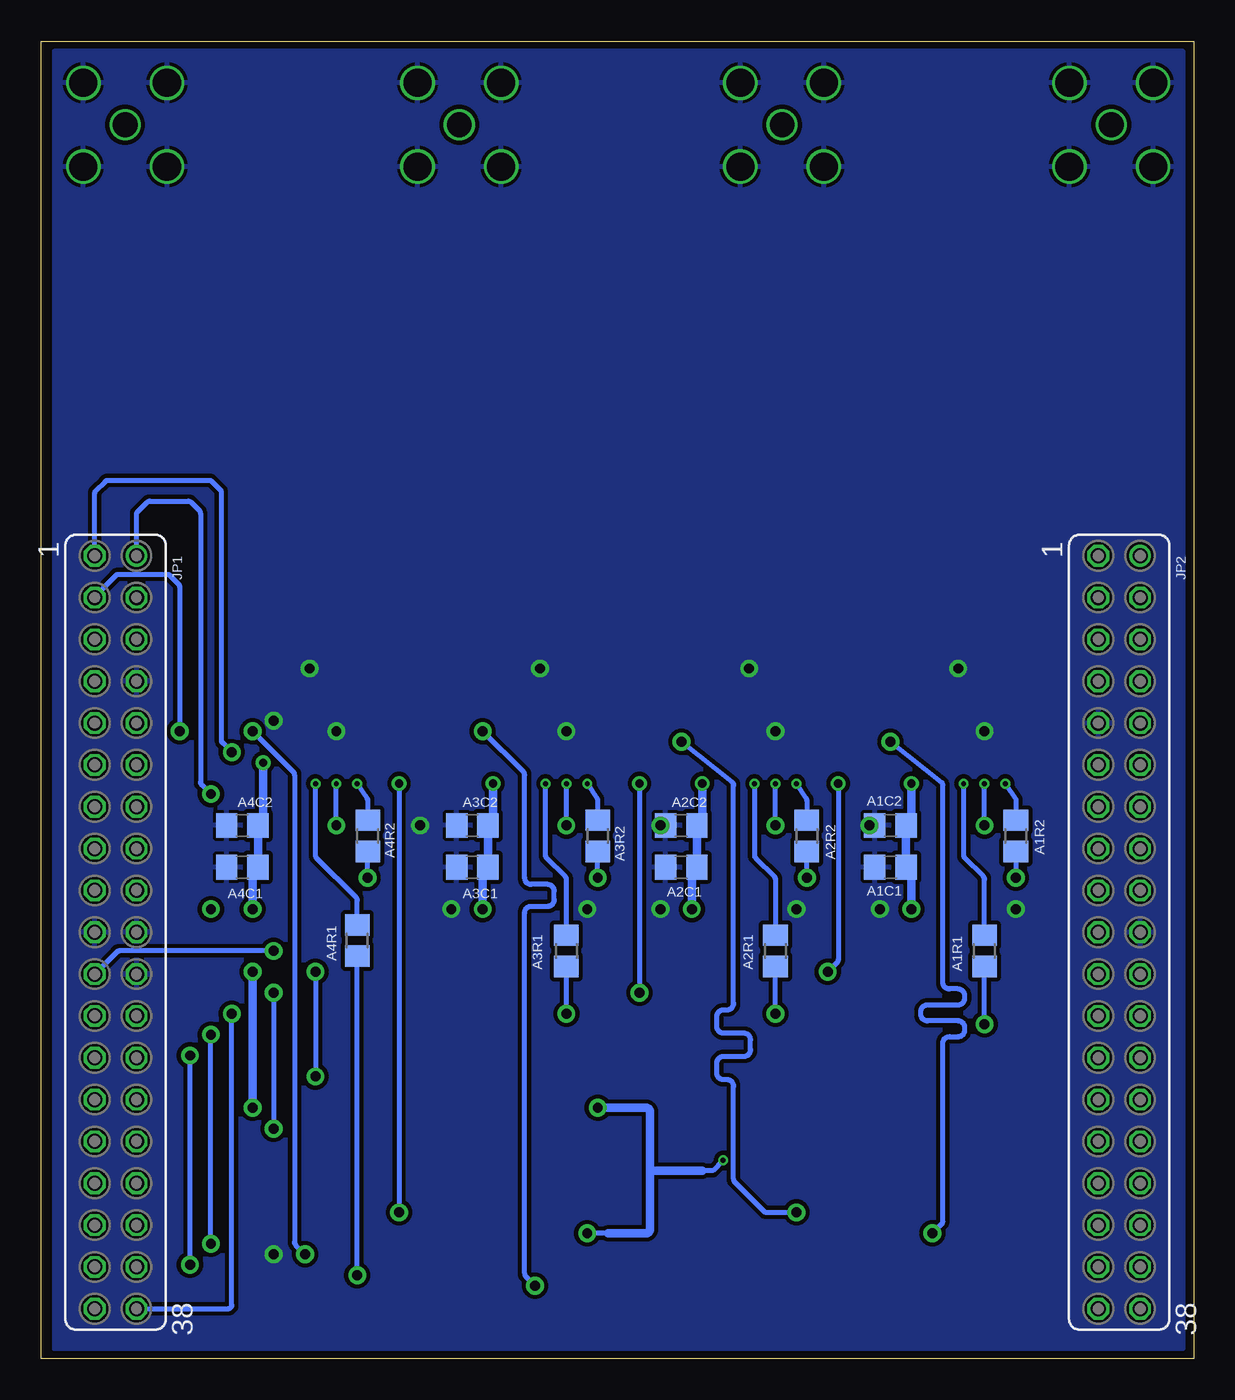
[diagram p7: board, bottom side, seen from below]

Size 70 x 80 mm. Coordinates in mm from the lower left corner, seen from the top.
Outline: 0,0 70,0 70,80 0,80 0,0
Copper layers (1*16): Top 0.035mm / dielectric 1.5mm / Bottom 0.035mm
Design rules "PCB-POOL Standard": minimum track width 0.15mm, minimum drill 0.3mm, track to track 0.15mm, track to pad 0.15mm, pad to pad 0.15mm, via to via 0.15mm, smd to smd 0.15mm, copper to edge 0.3mm, drill to drill 0.2mm, minimum pad ring 0.2mm, minimum via ring 0.15mm, stop-mask expansion 0.075mm, vias tented up to drill 0mil, thermal gap 0.2mm

### Footprints (pad centres in the part's own frame; a part is rotated, then mirrored left to right if it is on the bottom)
C0805 = smd 1.3 x 1.5: 1 -0.95,0; 2 0.95,0
R0805 = smd 1.3 x 1.5: 1 -0.95,0; 2 0.95,0
3MM2_X_2MM5 = smd 2 x 1.6: + -2.365,0; - 2.365,0
QFN20-4X4-0P5-PAD = smd 0.6 x 0.3: 1 -1.85,1; 2 -1.85,0.5; 3 -1.85,0; 4 -1.85,-0.5; 5 -1.85,-1; 11 1.85,-1; 12 1.85,-0.5; 13 1.85,0; 14 1.85,0.5; 15 1.85,1 | smd 0.3 x 0.6: 6 -1,-1.85; 7 -0.5,-1.85; 8 0,-1.85; 9 0.5,-1.85; 10 1,-1.85; 16 1,1.85; 17 0.5,1.85; 18 0,1.85; 19 -0.5,1.85; 20 -1,1.85 | smd 2.55 x 2.55: 21 0,0
SSOP20 = smd 0.3 x 1.1: 1 -2.833,-2.5; 2 -2.197,-2.5; 3 -1.562,-2.5; 4 -0.927,-2.5; 5 -0.292,-2.5; 6 0.343,-2.5; 7 0.978,-2.5; 8 1.613,-2.5; 9 2.248,-2.5; 10 2.882,-2.5; 11 2.882,2.4; 12 2.248,2.4; 13 1.613,2.4; 14 0.978,2.4; 15 0.343,2.4; 16 -0.292,2.4; 17 -0.927,2.4; 18 -1.562,2.4; 19 -2.197,2.4; 20 -2.833,2.4
SMA_SMT_AMPHENOL_901-143 = drill 1.499: 1 0,0 | drill 1.702: 2 -2.54,2.54; 3 -2.54,-2.54; 4 2.54,-2.54; 5 2.54,2.54
FE19-2 = drill 0.914 octagon: 1 -24.13,-1.27; 3 -21.59,-1.27; 4 -21.59,1.27; 5 -19.05,-1.27; 6 -19.05,1.27; 7 -16.51,-1.27; 8 -16.51,1.27; 9 -13.97,-1.27; 10 -13.97,1.27; 11 -11.43,-1.27; 12 -11.43,1.27; 13 -8.89,-1.27; 14 -8.89,1.27; 15 -6.35,-1.27; 16 -6.35,1.27; 17 -3.81,-1.27; 18 -3.81,1.27; 19 -1.27,-1.27; 20 -1.27,1.27; 21 1.27,-1.27; 22 1.27,1.27; 23 3.81,-1.27; 24 3.81,1.27; 25 6.35,-1.27; 26 6.35,1.27; 27 8.89,-1.27; 28 8.89,1.27; 29 11.43,-1.27; 30 11.43,1.27; 31 13.97,-1.27; 32 13.97,1.27; 33 16.51,-1.27; 34 16.51,1.27; 35 19.05,-1.27; 36 19.05,1.27; 37 21.59,-1.27; 38 21.59,1.27 | drill 0.914: 2 -24.13,1.27
ABM03B = smd 1.8 x 1.2: 1 -2,-1.2; 2 2,-1.2; 3 2,1.2; 4 -2,1.2
B1,27 = smd 1.27 x 1.27: TP 0,0

### Placement (x,y rotation side)
A1C1  18.41,29.84 180 bottom
A1C2  18.41,32.38 180 bottom
A1R1  12.7,24.77 90 bottom
A1R2  10.79,31.75 90 bottom
A2C1  31.11,29.84 180 bottom
A2C2  31.11,32.38 180 bottom
A2R1  25.4,24.77 90 bottom
A2R2  23.5,31.75 90 bottom
A3C1  43.81,29.84 180 bottom
A3C2  43.81,32.38 180 bottom
A3R1  38.1,24.77 90 bottom
A3R2  36.2,31.75 90 bottom
A4C1  57.78,29.84 180 bottom
A4C2  57.78,32.38 180 bottom
A4R1  50.8,25.4 90 bottom
A4R2  50.16,31.75 90 bottom
AX1_C1  10.16,43.18 180 top
AX1_C2  17.78,45.72 0 top
AX1_C3  16.51,50.8 180 top
AX1_C4  11.43,48.9 270 top
AX1_C5  16.51,57.15 180 top
AX1_C6  10.16,57.15 0 top
AX1_C7  13.97,60.96 270 top
AX1_C8  16.51,66.04 270 top
AX1_C9  10.16,64.77 180 top
AX1_C10  10.16,67.31 180 top
AX1_C13  17.78,40.64 0 top
AX1_C14  17.78,43.18 0 top
AX1_L1  8.89,39.37 270 top
AX1_L2  10.16,45.72 0 top
AX1_L3  16.51,48.26 0 top
AX1_L4  16.51,53.34 0 top
AX1_L5  11.43,53.34 270 top
AX1_L6  10.16,59.69 0 top
AX1_L7  16.51,60.96 270 top
AX1_L8  13.97,66.04 270 top
AX2_C1  22.86,43.18 180 top
AX2_C2  30.48,45.72 0 top
AX2_C3  29.21,50.8 180 top
AX2_C4  24.13,48.9 270 top
AX2_C5  29.21,57.15 180 top
AX2_C6  22.86,57.15 0 top
AX2_C7  26.67,60.96 270 top
AX2_C8  29.21,66.04 270 top
AX2_C9  22.86,64.77 180 top
AX2_C10  22.86,67.31 180 top
AX2_C13  30.48,40.64 0 top
AX2_C14  30.48,43.18 0 top
AX2_L1  21.59,39.37 270 top
AX2_L2  22.86,45.72 0 top
AX2_L3  29.21,48.26 0 top
AX2_L4  29.21,53.34 0 top
AX2_L5  24.13,53.34 270 top
AX2_L6  22.86,59.69 0 top
AX2_L7  29.21,60.96 270 top
AX2_L8  26.67,66.04 270 top
AX3_C1  35.56,43.18 180 top
AX3_C2  43.18,45.72 0 top
AX3_C3  41.91,50.8 180 top
AX3_C4  36.83,48.9 270 top
AX3_C5  41.91,57.15 180 top
AX3_C6  35.56,59.69 0 top
AX3_C7  39.37,60.96 270 top
AX3_C8  41.91,66.04 270 top
AX3_C9  35.56,64.77 180 top
AX3_C10  35.56,67.31 180 top
AX3_C13  43.18,40.64 0 top
AX3_C14  43.18,43.18 0 top
AX3_L1  34.29,39.37 270 top
AX3_L2  35.56,45.72 0 top
AX3_L3  41.91,48.26 0 top
AX3_L4  41.91,53.34 0 top
AX3_L5  36.83,53.34 270 top
AX3_L6  35.56,57.15 0 top
AX3_L7  41.91,60.96 270 top
AX3_L8  39.37,66.04 270 top
AX4_C1  49.53,43.18 180 top
AX4_C2  57.15,45.72 0 top
AX4_C3  55.88,50.8 180 top
AX4_C4  50.8,48.9 270 top
AX4_C5  55.88,57.15 180 top
AX4_C6  49.53,59.69 0 top
AX4_C7  53.34,60.96 270 top
AX4_C8  55.88,66.04 270 top
AX4_C9  49.53,64.77 180 top
AX4_C10  49.53,67.31 180 top
AX4_C13  57.15,40.64 0 top
AX4_C14  57.15,43.18 0 top
AX4_L1  48.26,39.37 270 top
AX4_L2  49.53,45.72 0 top
AX4_L3  55.88,48.26 0 top
AX4_L4  55.88,53.34 0 top
AX4_L5  50.8,53.34 270 top
AX4_L6  49.53,57.15 0 top
AX4_L7  55.88,60.96 270 top
AX4_L8  53.34,66.04 270 top
C1  40.64,10.16 180 top
C2  45.09,10.16 0 top
C3  40.64,12.7 180 top
C4  45.09,12.7 180 top
C5  40.64,15.24 0 top
C6  45.09,15.24 180 top
C7  33.02,17.14 0 top
CT1  13.97,13.34 270 top
IC1  12.7,38.1 270 top
IC2  25.4,38.1 270 top
IC3  38.1,38.1 270 top
IC4  52.07,38.1 270 top
IC5  33.02,11.43 270 top
J1  5,74.93 0 top
J2  25,74.93 0 top
J3  44.6,74.93 0 top
J4  64.9,74.93 0 top
JP1  65.48,24.63 270 bottom
JP2  4.52,24.63 270 bottom
Q2  22.86,13.97 0 top
R1  19.05,7.62 180 top
R2  24.13,6.35 180 top
R3  36.83,4.45 0 top
R4  45.72,6.35 0 top
R5  53.34,10.16 0 top
TP1  16,25.9 0 top
X_CE_LOGO  [CE_7.3MM]  67.31,53.34 90 top

### Tracks (layer width: path | path; a pad name or v marks a point on that pad's centre or on a via)
AX1_C3_L4
  Top 0.305: AX1_L4.2 AX1_C3.1
AX1_C4_L5
  Top 0.305: AX1_L5.2 AX1_C4.1
AX1_CH1_ANA1
  Top 0.305: IC1.1 13.7,40 arc-60 14.02,40.55 15.17,41.2 arc45 15.24,41.38 15.24,44.02 arc-45 15.31,44.2 AX1_C2.1
AX1_CH1_ANA2
  Top 0.305: IC1.5 11.7,40.11 arc45 11.51,40.56 arc-45 11.43,40.76 11.43,42.76 arc45 11.36,42.93 AX1_C1.1
AX1_CH1_ANTN
  Top 0.305: AX1_C4.2 11.43,46.04 AX1_L2.2 12.51,44.32 arc-45 12.7,43.87 12.7,42.81 arc-45 12.51,42.36 12.39,42.23 arc45 12.2,41.78 IC1.4
AX1_CH1_ANTP
  Top 0.305: AX1_C3.2 AX1_L3.1 13.52,46.22 arc45 13.34,45.77 13.34,42.17 arc-45 13.15,41.72 12.89,41.46 arc45 12.7,41.01 IC1.3
AX1_CH_1
  Top 0.305: AX1_C8.1 AX1_L8.1 13.65,67.31 AX1_C10.1 11.24,67.44 arc45 11.43,67.89 11.43,68.32 arc45 11.24,68.77 10.35,69.66 arc45 9.9,69.85 6.61,69.85 arc-45 6.16,70.04 5.19,71.01 arc-45 5,71.46 J1.1
AX1_IRQ_1  (via drill 0.3)
  Top 0.305: IC1.14 13.2,35.8 arc45 13.27,35.62 v13.97,34.92
  Bottom 0.305: A1R1.2 12.7,29.11 arc-45 12.77,29.28 13.9,30.41 arc45 13.97,30.59 v13.97,34.92
AX1_L1
  Top 0.305: IC1.8 8.89,38.1 AX1_L1.2
AX1_L2
  Top 0.305: IC1.7 10.41,38.6 arc-90 10.16,38.85 10.16,40.39 arc90 9.91,40.64 8.89,40.64 AX1_L1.1
AX1_L4_C5_L7
  Top 0.305: AX1_L4.1 AX1_C5.2 15.56,57.84 arc-45 15.75,58.29 16.32,58.87 arc45 16.51,59.32 AX1_L7.2
AX1_L4_C7_L8
  Top 0.305: AX1_C8.2 AX1_L8.2 | AX1_L8.2 AX1_C7.1 AX1_L7.1 | AX1_C9.1 13.65,64.77 AX1_L8.2
AX1_L5_C6_L6_C7
  Top 0.305: AX1_C7.2 11.43,60.01 AX1_L6.2 AX1_C6.2 11.43,56.83 AX1_L5.1
AX1_MISO  (via drill 0.3)
  Top 0.305: IC1.12 12.2,35.8 arc-45 12.13,35.62 v11.43,34.92
  Bottom 0.305: v11.43,34.92 10.79,33.97 A1R2.2
AX2_C3_L4
  Top 0.305: AX2_C3.1 AX2_L4.2
AX2_C4_L5
  Top 0.305: AX2_L5.2 AX2_C4.1
AX2_CH2_ANA1
  Top 0.305: IC2.1 26.4,40.27 arc-45 26.47,40.44 27.87,41.2 arc45 27.94,41.38 27.94,43.87 arc-45 28.13,44.32 AX2_C2.1
AX2_CH2_ANA2
  Top 0.305: IC2.5 24.4,40.25 arc45 24.32,40.45 arc-45 24.13,40.9 24.13,42.76 arc45 24.06,42.93 AX2_C1.1
AX2_CH2_ANTN
  Top 0.305: AX2_C4.2 23.81,47.95 AX2_L2.2 25.21,44.32 arc-45 25.4,43.87 25.4,42.81 arc-45 25.21,42.36 25.09,42.23 arc45 24.9,41.78 IC2.4
AX2_CH2_ANTP
  Top 0.305: AX2_C3.2 AX2_L3.1 26.22,46.22 arc45 26.04,45.77 26.04,42.17 arc-45 25.85,41.72 25.59,41.46 arc45 25.4,41.01 IC2.3
AX2_CH_2
  Top 0.305: AX2_C8.1 AX2_L8.1 26.67,67.31 AX2_C10.1 23.94,67.44 arc45 24.13,67.89 24.13,68.32 arc-45 24.32,68.77 24.81,69.26 arc45 25,69.71 J2.1
AX2_IRQ_2  (via drill 0.3)
  Top 0.305: IC2.14 25.9,35.8 arc45 25.97,35.62 v26.67,34.92
  Bottom 0.305: v26.67,34.92 26.67,30.59 arc-45 26.6,30.41 25.47,29.28 arc45 25.4,29.11 A2R1.2
AX2_L1
  Top 0.305: IC2.8 21.59,38.1 AX2_L1.2
AX2_L2
  Top 0.305: IC2.7 23.11,38.6 arc-90 22.86,38.85 22.86,40.39 arc90 22.61,40.64 21.59,40.64 AX2_L1.1
AX2_L4_C5_L7
  Top 0.305: AX2_L4.1 AX2_C5.2 28.57,57.78 28.57,58.16 arc-45 28.76,58.61 29.02,58.87 arc45 29.21,59.32 AX2_L7.2
AX2_L4_C7_L8
  Top 0.305: AX2_L8.2 23.81,65.09 AX2_C9.1 | AX2_C8.2 AX2_L8.2 | AX2_L8.2 AX2_C7.1 AX2_L7.1
AX2_L5_C6_L6_C7
  Top 0.305: AX2_C7.2 23.81,60.01 AX2_L6.2 AX2_C6.2 23.81,54.29 AX2_L5.1
AX2_MISO  (via drill 0.3)
  Top 0.305: IC2.12 24.9,35.8 arc-45 24.83,35.62 v24.13,34.92
  Bottom 0.305: v24.13,34.92 23.54,34.03 arc34 23.5,33.89 A2R2.2
AX3_C3_L4
  Top 0.305: AX3_L4.2 AX3_C3.1
AX3_C4_L5
  Top 0.305: AX3_L5.2 AX3_C4.1
AX3_CH3_ANA1
  Top 0.305: IC3.1 39.1,40 arc-60 39.42,40.55 40.57,41.2 arc45 40.64,41.38 40.64,43.39 arc-45 40.71,43.57 AX3_C2.1
AX3_CH3_ANA2
  Top 0.305: IC3.5 37.1,40.25 arc45 37.02,40.45 arc-45 36.83,40.9 36.83,42.76 arc45 36.76,42.93 AX3_C1.1
AX3_CH3_ANTN
  Top 0.305: AX3_C4.2 36.51,47.95 AX3_L2.2 37.91,44.32 arc-45 38.1,43.87 38.1,42.81 arc-45 37.91,42.36 37.79,42.23 arc45 37.6,41.78 IC3.4
AX3_CH3_ANTP
  Top 0.305: AX3_C3.2 AX3_L3.1 38.92,46.22 arc45 38.73,45.77 38.73,42.17 arc-45 38.55,41.72 38.29,41.46 arc45 38.1,41.01 IC3.3
AX3_CH_3
  Top 0.305: AX3_C10.1 36.51,66.99 AX3_L8.1 AX3_C8.1 41.91,68.32 arc-45 42.1,68.77 44.26,70.93 arc45 44.45,71.38 44.45,74.57 arc-45 J3.1
AX3_IRQ_3  (via drill 0.3)
  Top 0.305: IC3.14 38.6,35.89 arc45 38.73,35.56 v39.37,34.92
  Bottom 0.305: A3R1.2 38.1,29.11 arc-45 38.17,29.28 39.3,30.41 arc45 39.37,30.59 v39.37,34.92
AX3_L1
  Top 0.305: IC3.8 34.29,38.1 AX3_L1.2
AX3_L2
  Top 0.305: IC3.7 35.56,38.6 35.56,40.64 34.29,40.64 AX3_L1.1
AX3_L4_C5_L7
  Top 0.305: AX3_L4.1 AX3_C5.2 41.27,57.78 41.27,58.16 arc-45 41.46,58.61 41.72,58.87 arc45 41.91,59.32 AX3_L7.2
AX3_L4_C7_L8
  Top 0.305: AX3_L7.1 AX3_C7.1 AX3_L8.2 | AX3_C8.2 AX3_L8.2 | AX3_L8.2 36.51,65.09 AX3_C9.1
AX3_L5_C6_L6_C7
  Top 0.305: AX3_C7.2 36.51,60.01 AX3_C6.2 AX3_L6.2 36.83,57.15 AX3_L5.1
AX3_MISO  (via drill 0.3)
  Top 0.305: IC3.12 37.6,35.7 v36.83,34.92
  Bottom 0.305: v36.83,34.92 36.24,34.03 arc34 36.2,33.89 A3R2.2
AX4_C3_L4
  Top 0.305: AX4_L4.2 AX4_C3.1
AX4_C4_L5
  Top 0.305: AX4_L5.2 AX4_C4.1
AX4_CH4_ANA1
  Top 0.305: IC4.1 53.07,40.27 arc-45 53.14,40.44 54.54,41.2 arc45 54.61,41.38 54.61,43.26 arc-35 54.73,43.63 AX4_C2.1
AX4_CH4_ANA2
  Top 0.305: IC4.5 51.07,40.25 arc45 50.99,40.45 arc-45 50.8,40.9 50.8,42.76 arc45 50.73,42.93 AX4_C1.1
AX4_CH4_ANTN
  Top 0.305: AX4_C4.2 50.8,46.04 AX4_L2.2 52,44.2 arc-45 52.07,44.02 52.07,42.81 arc-45 51.88,42.36 51.76,42.23 arc45 51.57,41.78 IC4.4
AX4_CH4_ANTP
  Top 0.305: AX4_C3.2 AX4_L3.1 52.89,46.22 arc45 52.7,45.77 52.7,42.17 arc-45 52.52,41.72 52.26,41.46 arc45 52.07,41.01 IC4.3
AX4_CH_4
  Top 0.305: J4.1 64.9,70.24 arc-45 64.71,69.79 63.69,68.77 arc-45 63.24,68.58 57.73,68.58 arc45 57.28,68.39 AX4_C8.1 AX4_L8.1 50.48,66.99 AX4_C10.1
AX4_IRQ_4  (via drill 0.3)
  Top 0.305: IC4.14 52.57,35.89 arc45 52.7,35.56 v53.34,34.92
  Bottom 0.305: A4R1.2 50.8,27.84 arc-45 50.87,28.01 53.27,30.41 arc45 53.34,30.59 v53.34,34.92
AX4_L1
  Top 0.305: IC4.8 48.26,38.1 AX4_L1.2
AX4_L2
  Top 0.305: IC4.7 49.78,38.6 arc-90 49.53,38.85 49.53,40.39 arc90 49.28,40.64 48.26,40.64 AX4_L1.1
AX4_L4_C5_L7
  Top 0.305: AX4_L4.1 AX4_C5.2 55.24,57.78 55.24,58.16 arc-45 55.43,58.61 55.69,58.87 arc45 55.88,59.32 AX4_L7.2
AX4_L4_C7_L8
  Top 0.305: AX4_C8.2 AX4_L8.2 | AX4_L8.2 AX4_C7.1 AX4_L7.1 | AX4_L8.2 50.48,65.09 AX4_C9.1
AX4_L5_C6_L6_C7
  Top 0.305: AX4_C7.2 50.48,60.01 AX4_C6.2 AX4_L6.2 50.8,57.15 AX4_L5.1
AX4_MISO  (via drill 0.3)
  Top 0.305: IC4.12 51.57,35.8 arc-45 51.5,35.62 v50.8,34.92
  Bottom 0.305: v50.8,34.92 50.21,34.03 arc34 50.16,33.89 A4R2.2
BUF_CLK_1  (via drill 0.6)
  Top 0.305: v15.88,7.62 R1.2 | AX1_C13.2 18.73,37.88 arc-45 18.66,37.71 v18.41,37.47
  Bottom 0.305: v18.41,37.47 15.31,35 arc45 15.24,34.82 15.24,22.86 arc-90 14.83,22.45 14.31,22.45 arc90 13.9,22.05 13.9,21.89 arc90 14.31,21.49 16.17,21.49 arc-90 16.57,21.08 16.57,20.93 arc-90 16.17,20.52 14.31,20.52 arc90 13.9,20.11 13.9,19.96 arc90 14.31,19.56 14.83,19.56 arc-90 15.24,19.15 15.24,8.36 arc45 15.31,8.18 v15.88,7.62
BUF_CLK_2  (via drill 0.6)
  Top 0.305: v24.13,8.89 23.57,8.33 arc45 23.5,8.15 23.5,6.67 R2.2 | AX2_C13.2 31.43,37.88 arc-45 31.36,37.71 v31.11,37.47
  Bottom 0.305: v31.11,37.47 28.01,35 arc45 27.94,34.82 27.94,21.59 arc90 28.35,21.18 28.56,21.18 arc-90 28.97,20.78 28.97,20.18 arc-90 28.56,19.77 27.32,19.77 arc90 26.91,19.36 26.91,18.77 arc90 27.32,18.36 28.56,18.36 arc-90 28.97,17.95 28.97,17.35 arc-90 28.56,16.95 28.35,16.95 arc90 27.94,16.54 27.94,10.9 arc-45 27.87,10.72 26.11,8.96 arc-45 25.93,8.89 v24.13,8.89
BUF_CLK_3  (via drill 0.6)
  Top 0.305: R3.2 v40.01,4.45 | v43.18,38.1 44.38,39.3 arc45 44.45,39.48 44.45,40.32 AX3_C13.2
  Bottom 0.305: v43.18,38.1 40.71,35.63 arc45 40.64,35.45 40.64,29.21 arc-90 40.23,28.8 39.24,28.8 arc90 38.84,28.4 38.84,27.88 arc90 39.24,27.48 40.23,27.48 arc-90 40.64,27.07 40.64,5.18 arc-45 40.57,5.01 v40.01,4.45
BUF_CLK_4  (via drill 0.6)
  Top 0.305: AX4_C13.2 58.1,39.16 arc-45 58.03,38.98 v57.15,38.1 | v53.98,6.35 R4.2
  Bottom 0.305: v57.15,38.1 54.68,35.63 arc45 54.61,35.45 54.61,7.09 arc-45 54.54,6.91 v53.98,6.35
BUF_CLK_A1
  Top 0.305: AX1_C14.1 AX1_C13.1 15.36,39.17 arc-45 15.19,39.1 IC1.20
BUF_CLK_A2
  Top 0.305: AX2_C14.1 AX2_C13.1 28.06,39.17 arc-45 27.89,39.1 IC2.20
BUF_CLK_A3
  Top 0.305: IC3.20 40.59,39.1 arc45 40.76,39.17 AX3_C13.1 AX3_C14.1
BUF_CLK_A4
  Top 0.305: IC4.20 54.55,39.1 arc45 54.73,39.17 AX4_C13.1 AX4_C14.1
BUF_CLK_MCU
  Top 0.305: JP1.29 66.54,13.2 65.48,12.14 arc-45 65.3,12.06 56.3,12.06 arc45 56.12,11.99 R5.2
BUF_O_CLK_1
  Top 0.305: IC5.7 27.07,10.45 arc45 26.89,10.38 26.74,10.23 arc-45 26.57,10.16 23.6,10.16 arc45 23.42,10.09 21.03,7.69 arc-45 20.85,7.62 R1.1
BUF_O_CLK_2
  Top 0.305: IC5.8 27.7,9.82 arc45 27.52,9.74 26.74,8.96 arc45 26.67,8.79 26.67,7.09 arc-45 26.6,6.91 26.11,6.42 arc-45 25.93,6.35 R2.1
BUF_O_CLK_3
  Top 0.305: IC5.9 28.34,9.18 arc45 28.16,9.11 28.01,8.96 arc45 27.94,8.79 27.94,5.18 arc45 28.01,5.01 28.5,4.52 arc45 28.68,4.45 R3.1
BUF_O_CLK_4
  Top 0.305: IC5.10 29.61,8.55 arc45 29.43,8.47 29.28,8.33 arc45 29.21,8.15 29.21,5.97 arc90 29.46,5.71 32.91,5.71 arc45 33.09,5.79 33.58,6.28 arc-45 33.76,6.35 R4.1
BUF_O_CLK_MCU
  Top 0.305: IC5.12 36.43,9.18 arc-45 37.25,9.11 37.39,8.33 arc45 37.57,8.26 46.25,8.26 arc45 46.43,8.33 48.19,10.09 arc-45 48.37,10.16 R5.1
BUFF_X1
  Top 0.305: Q2.1 21.59,12.77 21.59,11.43 | 21.59,11.43 21.59,11.05 arc-90 21.34,10.79 13.97,10.79 CT1.- | IC5.3 27.07,12.99 arc45 26.89,12.92 26.74,12.77 arc45 26.67,12.6 26.67,11.68 arc-90 26.42,11.43 21.59,11.43
BUFF_X2
  Top 0.305: C7.1 29.95,17.14 arc45 29.77,17.07 29.28,16.58 arc45 29.21,16.41 29.21,13.97 | IC5.2 29.66,13.63 arc-45 29.48,13.7 29.21,13.97 | 29.21,13.97 26.06,13.97 Q2.3
GND  (via drill 0.6)
  Top 0.305: IC4.2 52.57,40.67 arc-45 52.64,40.85 v53.7,41.91 | IC4.18 52.96,38.1 arc-90 52.7,38.35 52.7,39.31 52.58,39.44 52.58,39.68 52.57,39.68 | IC4.17 52.57,37.6 IC4.21 | IC3.2 38.6,40.81 v39.7,41.91 | IC2.2 25.9,40.81 v27,41.91 | IC1.2 13.2,40.81 v14.3,41.91 | IC3.18 39.37,38.1 38.73,38.73 38.6,38.73 38.6,39.43 IC3.2 | IC3.17 38.1,37.6 IC3.21 | IC2.18 26.04,38.1 26.04,38.73 25.91,38.73 25.91,39.41 25.9,39.41 25.9,39.89 | IC2.17 25.4,37.6 IC2.21 | 13.67,37.6 12.7,37.6 IC1.21 IC1.18 | IC1.17 13.67,37.6 | 13.67,37.6 13.34,38.73 13.2,38.73 13.2,39.42 IC1.2
  other vias: 55.88,6.35 10.79,27.3 19.05,27.3 24.13,27.3 32.38,27.3 36.83,27.3 45.09,27.3 46.99,32.38 19.68,32.38 32.38,32.38 52.07,38.1 38.1,38.1 25.4,38.1 12.7,38.1 55.88,38.73
  pour Bottom (isolate 0.254): 0.64,79.38 69.22,79.38 69.22,0.64 0.64,0.64
  pour Top (isolate 0.254): 0.64,79.38 69.22,79.38 69.22,0.64 0.64,0.64
MCU_3V3  (via drill 0.3, 0.5, 0.6)
  Top 0.305: IC2.16 27.57,37.1 arc-45 27.74,37.03 v29.84,34.92 | IC4.16 54.23,37.1 arc-45 54.41,37.03 55.17,36.27 arc45 55.35,36.2 v56.52,36.2 | IC3.16 40.27,37.1 arc-45 40.44,37.03 v42.55,34.92 | IC1.16 14.87,37.1 arc-45 15.04,37.03 v17.14,34.92 | IC5.15 36.38,11.09 arc45 36.56,11.16 36.83,11.43 36.61,11.65 arc45 36.43,11.72 IC5.16 | IC5.20 36.43,14.26 arc-45 36.61,14.19 36.83,13.97 | IC5.11 35.8,8.55 arc-45 35.98,8.47 v36.83,7.62 | IC5.4 28.87,12.36 v28.57,12.06
  Top 0.508: JP1.12 61.56,36.06 arc45 61.39,35.99 61.03,35.63 arc45 60.96,35.45 60.96,30.48 | 60.96,30.48 63.71,30.48 JP1.16 | 60.96,26.04 57.15,26.04 | 57.15,26.04 43.18,26.04 | 43.18,26.04 30.48,26.04 | v30.48,27.3 30.48,26.04 | v43.18,27.3 43.18,26.04 | v57.15,27.3 57.15,26.04 | 60.96,26.04 60.96,23.75 arc-90 60.71,23.5 v57.15,23.5 | 30.48,26.04 17.4,26.04 arc-90 17.14,26.29 v17.14,27.3 | v57.15,15.24 47.88,15.24 arc-90 47.62,15.49 47.62,16.89 arc90 47.37,17.14 44.39,17.14 arc90 44.13,16.89 C6.2 C4.2 C2.1 C1.1 41.84,10.41 arc45 41.91,10.59 41.91,12.28 arc45 41.84,12.45 C3.1 C5.2 41.84,15.49 arc45 41.91,15.66 41.91,16.89 arc90 41.66,17.14 38.2,17.14 arc45 38.03,17.07 37.54,16.58 arc45 37.47,16.41 37.47,15.24 | 36.83,11.43 36.83,13.97 37.39,14.53 arc45 37.47,14.71 37.47,15.24 | 37.47,15.24 v36.2,15.24 | 60.96,26.04 60.96,30.48
  Bottom 0.305: 35.56,7.62 v36.83,7.62 | v28.57,12.06 29.21,11.43 29.84,11.43
  Bottom 0.508: v17.14,27.3 17.14,30.16 A1C1.1 A1C2.1 17.14,32.7 v17.14,34.92 | v29.84,34.92 29.84,32.7 A2C2.1 A2C1.1 30.48,29.53 v30.48,27.3 | v42.55,34.92 42.55,32.7 A3C2.1 A3C1.1 43.18,29.53 v43.18,27.3 | v57.15,27.3 57.15,29.53 A4C1.1 A4C2.1 56.52,32.7 v56.52,36.2 | v57.15,23.5 v57.15,15.24 | v36.2,15.24 33.27,15.24 arc90 33.02,14.99 33.02,11.43 | 33.02,11.43 33.02,7.87 arc90 33.27,7.62 35.56,7.62 | 29.84,11.43 33.02,11.43
MCU_CLK  (via drill 0.6)
  Top 0.305: v58.42,36.83 55.24,33.66 49.42,33.66 | 22.86,33.66 35.51,33.66 | 35.51,33.66 49.42,33.66 | 22.86,33.66 10.41,33.66 arc-90 10.16,33.91 10.16,34.6 arc-45 10.23,34.78 IC1.11 | 22.86,33.66 22.86,34.28 arc45 22.86,34.29 22.86,34.6 arc-45 22.93,34.78 IC2.11 | 35.51,33.66 35.51,34.56 arc-45 35.59,34.74 IC3.11 | 49.42,33.66 49.42,34.49 arc-45 49.49,34.67 IC4.11
  Bottom 0.305: JP1.1 66.75,52.52 arc45 66.68,52.7 66.11,53.27 arc45 65.94,53.34 59.8,53.34 arc45 59.62,53.27 59.13,52.78 arc45 59.05,52.6 59.05,37.57 arc-45 58.98,37.39 v58.42,36.83
MCU_IRQ_1  (via drill 0.6)
  Top 0.305: JP1.36 61.09,5.58 v60.96,5.71 | v60.96,18.41 15.24,18.41 v12.7,20.32
  Bottom 0.305: v60.96,5.71 v60.96,18.41 | v12.7,20.32 A1R1.1
MCU_IRQ_2  (via drill 0.6)
  Top 0.305: JP1.35 66.75,5.64 65.48,6.91 arc45 65.3,6.99 v59.69,6.99 | v59.69,19.68 26.67,19.68 v25.4,20.95
  Bottom 0.305: v59.69,6.99 v59.69,19.68 | v25.4,20.95 A2R1.1
MCU_IRQ_3  (via drill 0.6)
  Top 0.305: v58.42,20.95 v38.1,20.95
  Bottom 0.305: JP1.38 58.64,3.04 arc-45 58.49,3.1 arc-45 58.42,3.28 v58.42,20.95 | v38.1,20.95 A3R1.1
MCU_IRQ_4  (via drill 0.6)
  Top 0.305: JP1.37 66.75,3.1 65.48,4.37 arc45 65.3,4.45 51.54,4.45 arc-45 51.36,4.52 v50.8,5.08
  Bottom 0.305: v50.8,5.08 A4R1.1
MCU_MISO  (via drill 0.6)
  Top 0.305: v10.79,29.21 10.79,28.83 arc90 11.05,28.57 23.5,28.57 | 23.5,28.57 36.2,28.57 | 36.2,28.57 50.16,28.57 | v59.69,34.29 54.05,28.65 arc-45 53.87,28.57 50.16,28.57 | 23.5,28.57 v23.5,29.21 | 36.2,28.57 v36.2,29.21 | v50.16,29.21 50.16,28.57
  Bottom 0.305: A1R2.1 v10.79,29.21 | v23.5,29.21 A2R2.1 | v36.2,29.21 A3R2.1 | v50.16,29.21 A4R2.1 | JP1.2 64.21,51.26 arc45 64.14,51.43 63.57,52 arc45 63.4,52.07 61.06,52.07 arc45 60.89,52 60.4,51.51 arc45 60.33,51.33 60.33,35.03 arc-45 60.25,34.85 v59.69,34.29
MCU_MOSI  (via drill 0.3, 0.6)
  Top 0.305: 52.07,31.11 38.1,31.11 | 38.1,31.11 25.4,31.11 | 25.4,31.11 12.95,31.11 arc-90 12.7,31.37 v12.7,32.38 | v12.7,34.92 IC1.13 | 25.4,31.11 v25.4,32.38 | v25.4,34.92 IC2.13 | 38.1,31.11 v38.1,32.38 | v38.1,34.92 IC3.13 | 52.07,31.11 v52.07,32.38 | v52.07,34.92 IC4.13 | v61.59,38.1 54.61,31.11 52.07,31.11
  Bottom 0.305: v12.7,32.38 v12.7,34.92 | v25.4,32.38 v25.4,34.92 | v38.1,32.38 v38.1,34.92 | v52.07,32.38 v52.07,34.92 | JP1.3 66.75,46.28 65.48,47.55 arc45 65.3,47.62 62.34,47.62 arc45 62.16,47.55 61.67,47.06 arc45 61.59,46.88 v61.59,38.1
MCU_SEL1  (via drill 0.6)
  Top 0.305: IC1.10 10.43,37.1 8.96,35.63 arc45 8.89,35.45 8.89,26.14 arc45 8.96,25.96 10.09,24.84 arc45 10.27,24.77 v55.88,24.77
  Bottom 0.305: v55.88,24.77 65.24,24.77 arc-45 65.42,24.69 JP1.21
MCU_SEL2  (via drill 0.5, 0.6)
  Top 0.305: v22.23,23.5 v53.34,23.5 | v53.34,17.14 62.7,17.14 arc-45 62.88,17.07 JP1.28 | IC2.10 23.23,37.1 arc45 23.06,37.03 21.66,35.63 arc45 21.59,35.45 v21.59,34.92
  Bottom 0.305: v53.34,23.5 v53.34,17.14 | v21.59,34.92 21.59,24.23 arc45 21.66,24.06 v22.23,23.5
MCU_SEL3  (via drill 0.5, 0.6)
  Top 0.305: IC3.10 35.83,37.1 v33.66,34.92 | v33.66,22.23 v55.88,22.23 | v55.88,13.97 63.34,13.97 arc-45 63.51,13.9 JP1.30
  Bottom 0.305: v33.66,34.92 v33.66,22.23 | v55.88,22.23 v55.88,13.97
MCU_SEL4  (via drill 0.5, 0.6)
  Top 0.305: v48.26,34.92 48.26,35.03 arc-45 48.33,35.21 IC4.10 | JP1.34 49.13,8.12 arc-45 48.96,8.19 v48.26,8.89
  Bottom 0.305: v48.26,34.92 v48.26,8.89
N$1  (via drill 0.6)
  other vias: 59.69,27.3
N$2
  cutout Top (isolate 0.254): 54.11,38.23 53.3,38.23 53.3,37.47 54.11,37.47
  cutout Top (isolate 0.254): 40.14,38.23 39.34,38.23 39.34,37.47 40.14,37.47
  cutout Top (isolate 0.254): 27.44,38.23 26.64,38.23 26.64,37.47 27.44,37.47
  cutout Top (isolate 0.254): 14.74,38.23 13.94,38.23 13.94,37.47 14.74,37.47

### Text on the board
tPlace: Ch. 1 | Ch. 2 | Ch. 3 | Ch. 4 | 4 ch. VHF / UHF TRX | (c) 2018 Hochschule Mannheim / Institut fuer Hochfrequenztechnik | V 1.0